# EAGLE board homecontroller_main_new (EAGLE 6.6.0)
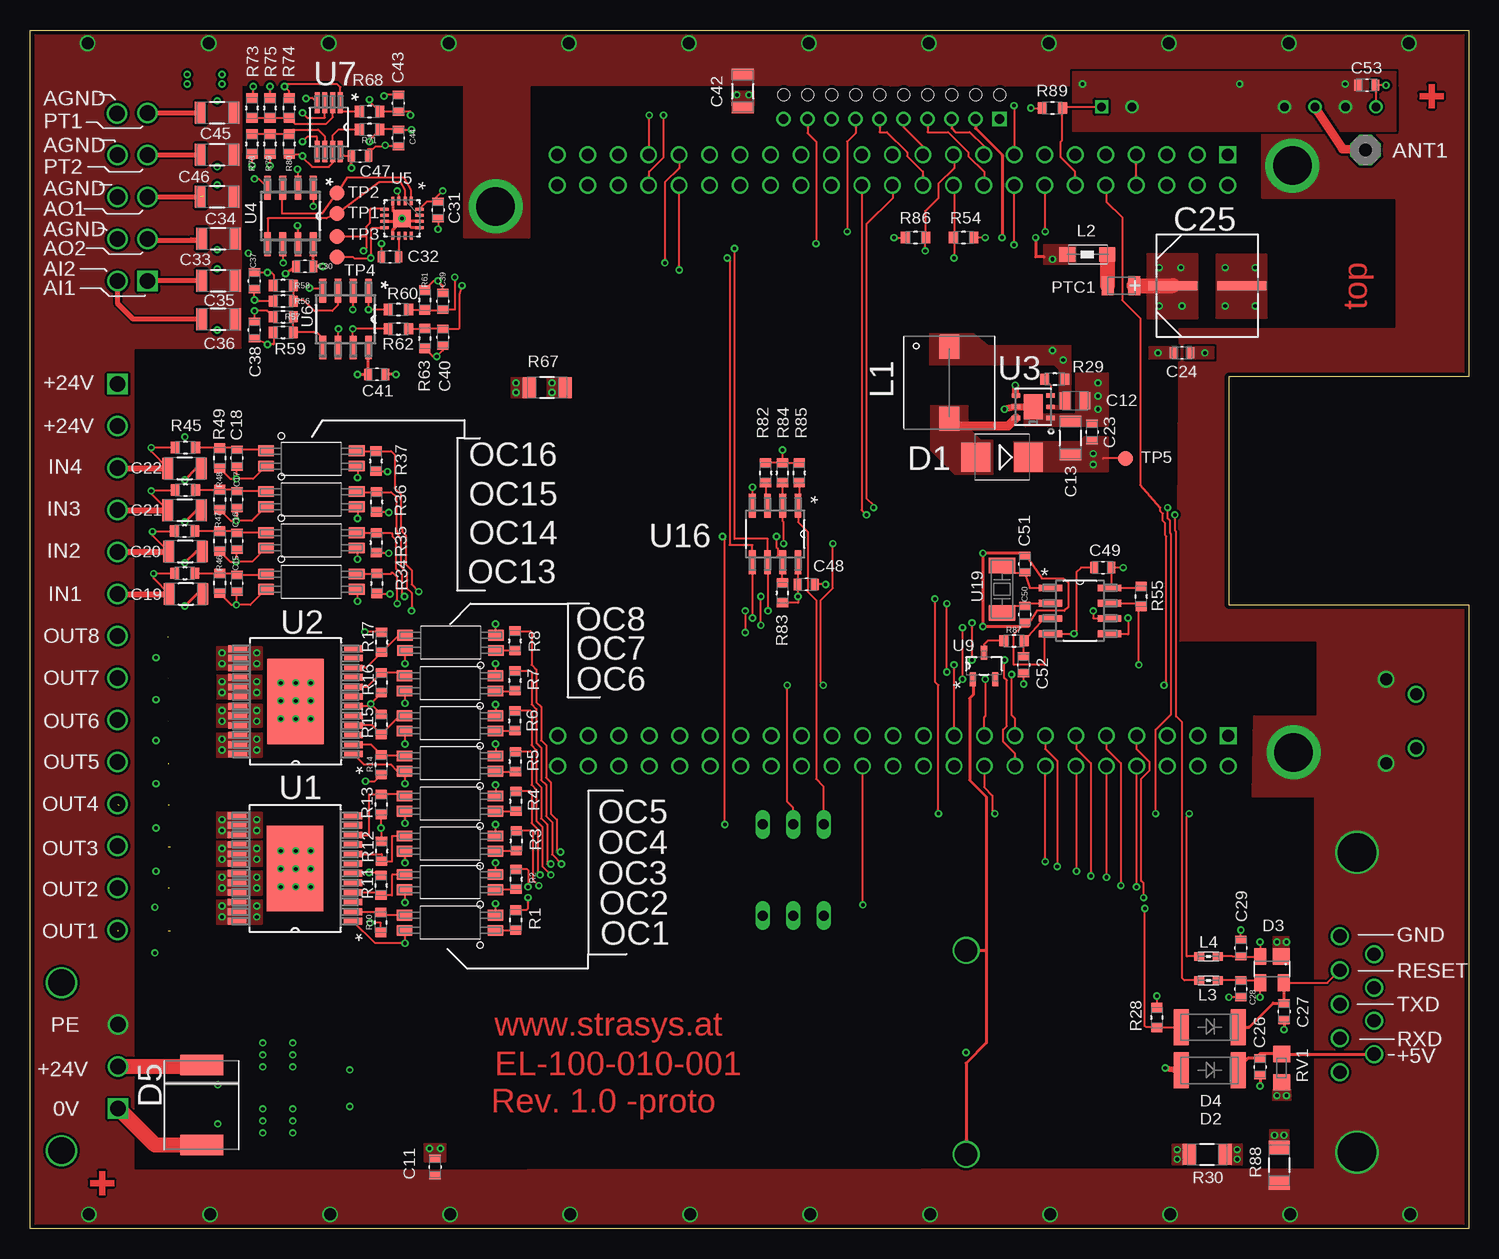
[diagram p7: board, top side]
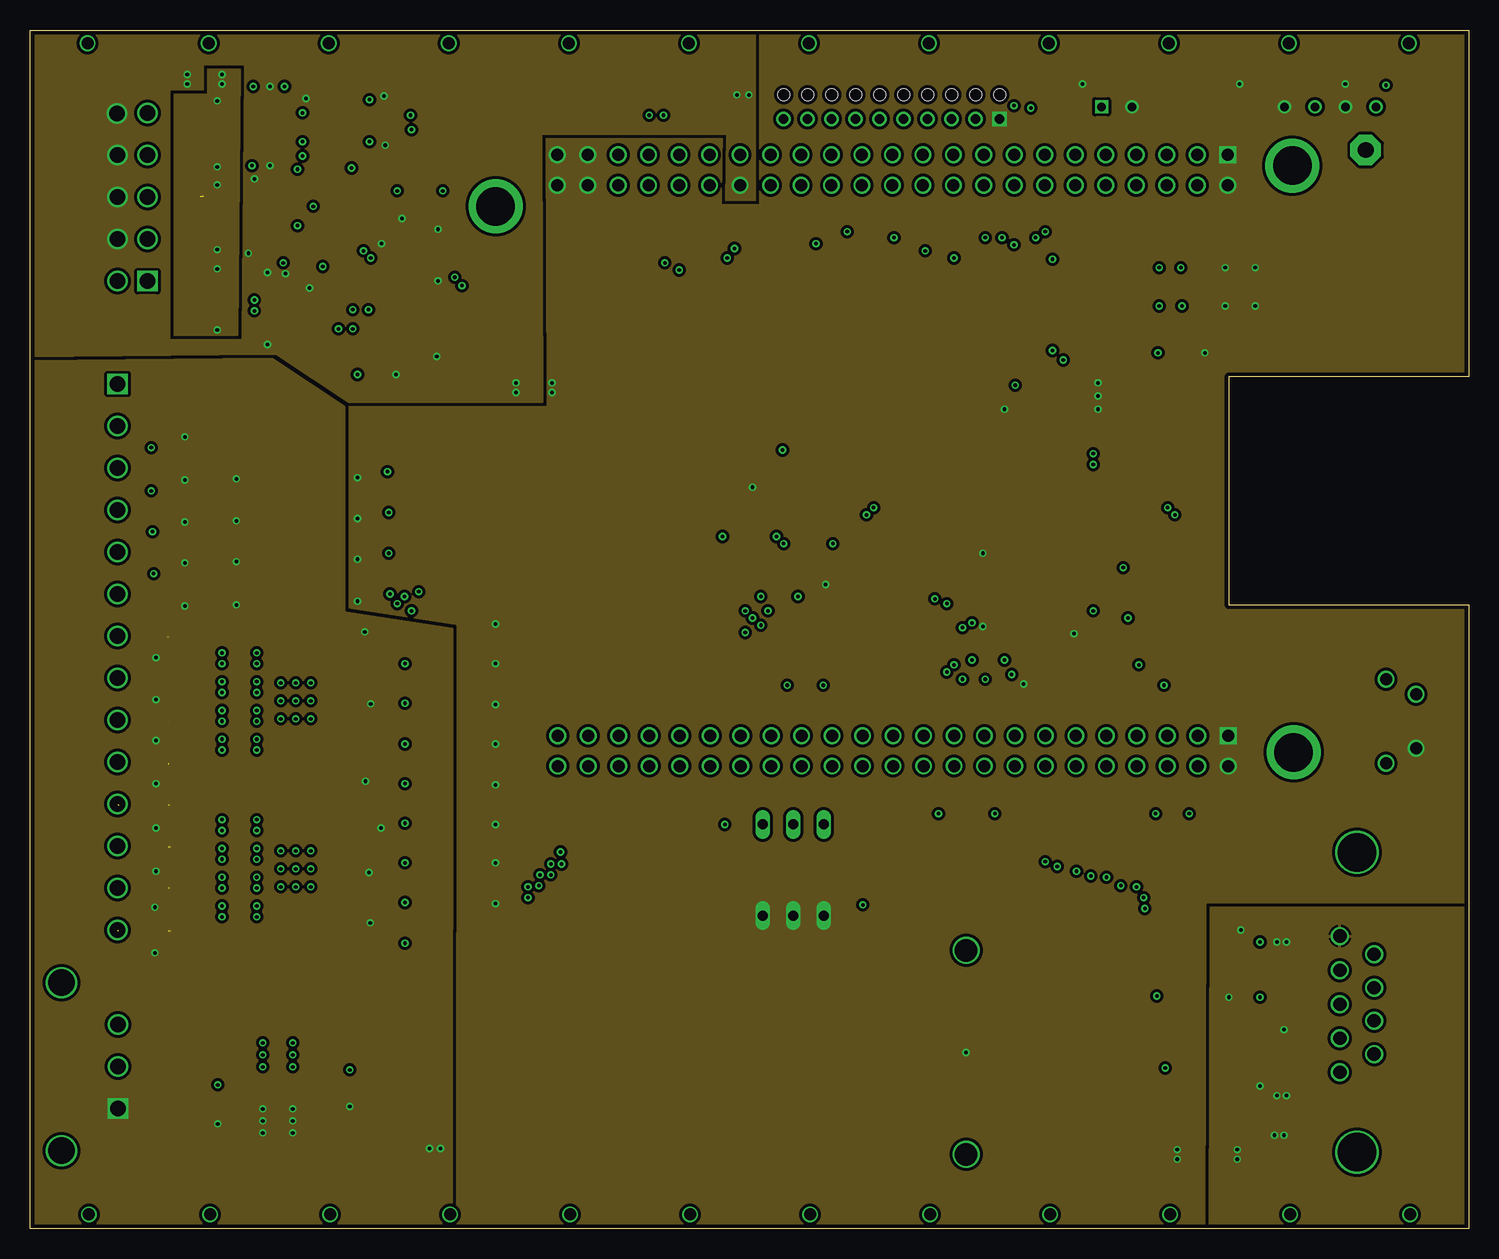
[diagram p8: board, inner layer GND]
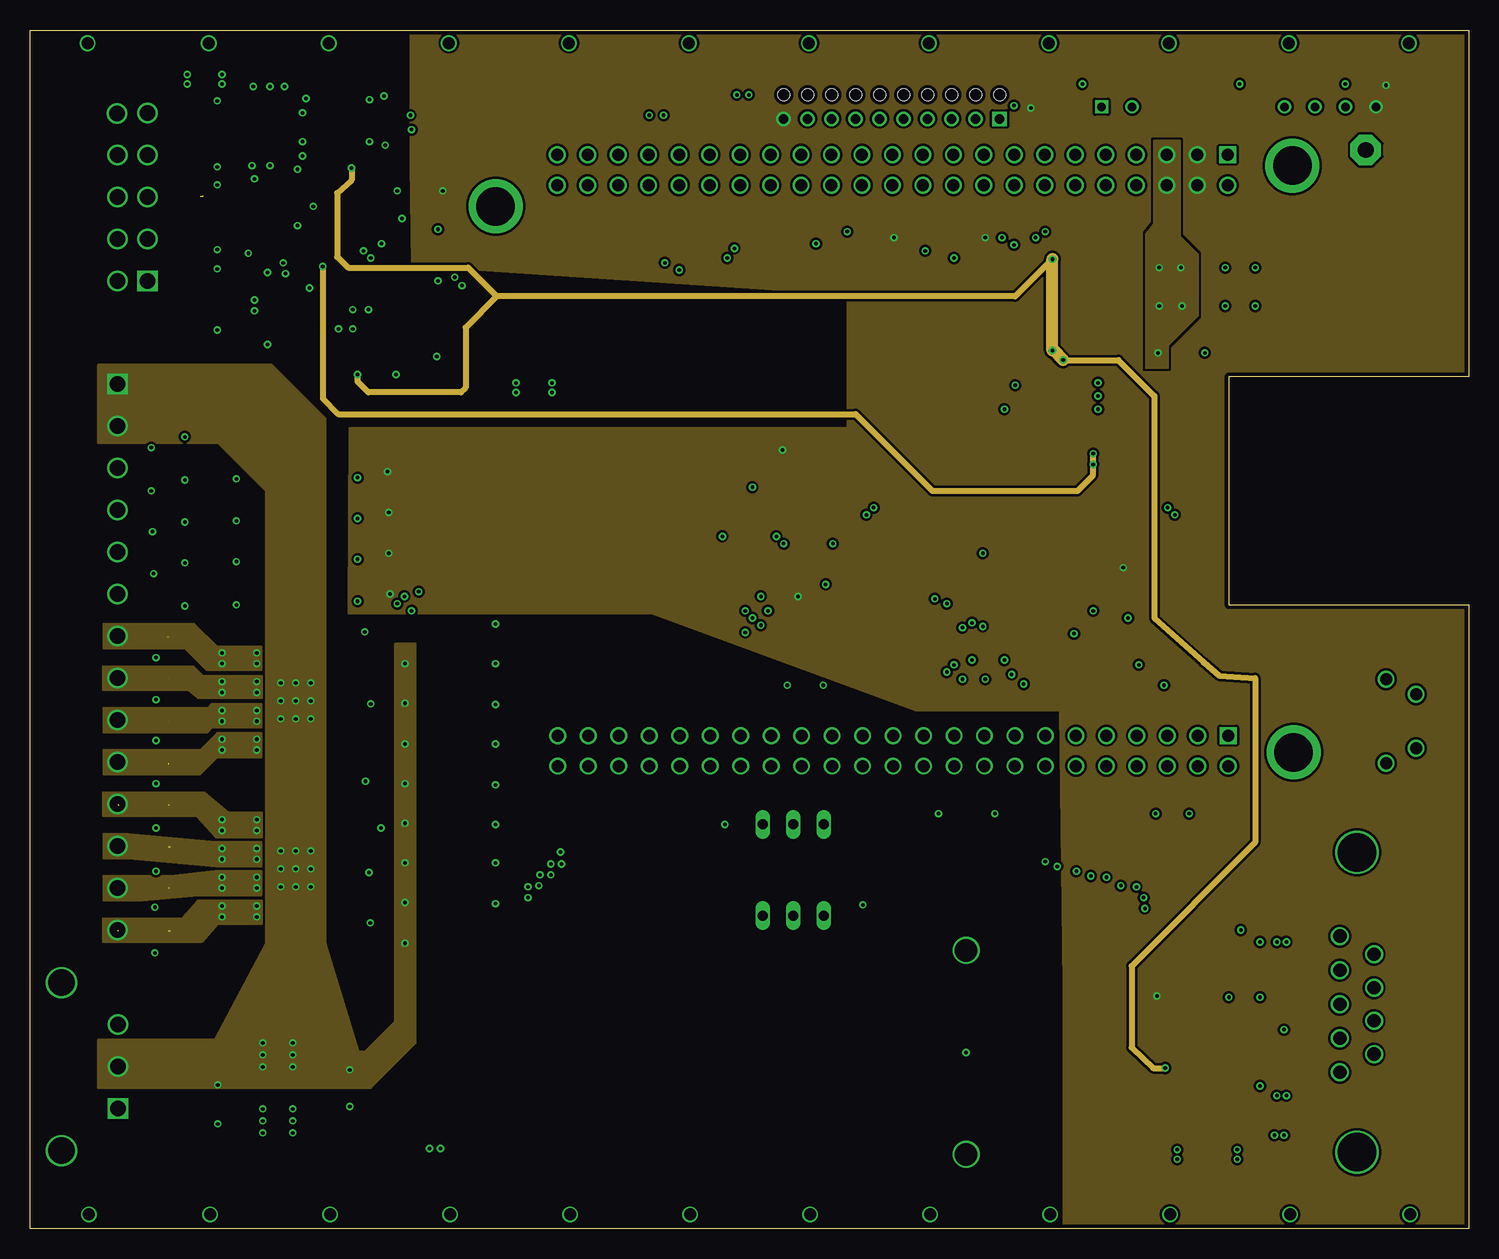
[diagram p9: board, inner layer PWR]
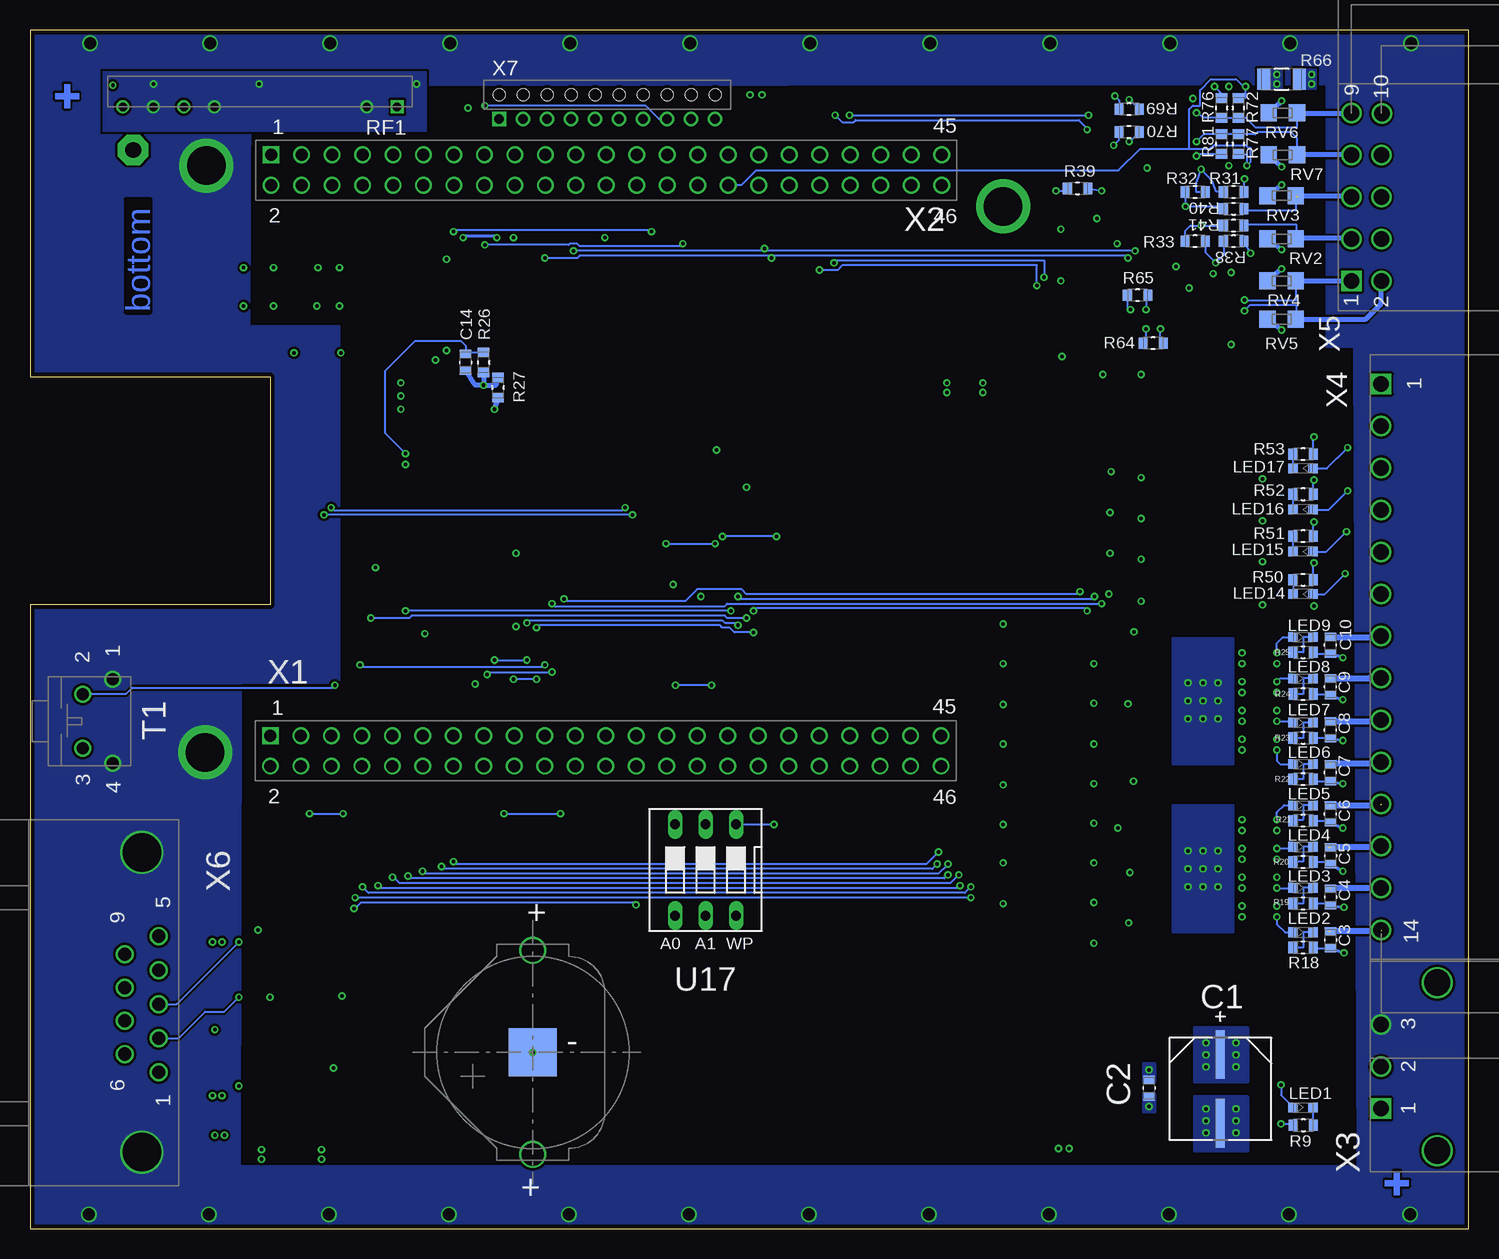
[diagram p10: board, bottom side, seen from below]

Size 119.9 x 99.9 mm. Coordinates in mm from the lower left corner, seen from the top.
Outline: 0,0 0,99.9 119.9,99.9 119.9,71 99.9,71 99.9,52 119.9,52 119.9,0 0,0
Copper layers (1+2*15+16): Top 0.035mm / dielectric 0.38mm / GND 0.035mm / dielectric 0.71mm / PWR 0.035mm / dielectric 0.38mm / Bottom 0.035mm
Design rules "PCB-POOL Standard_ML4": minimum track width 0.15mm, minimum drill 0.3mm, track to track 0.15mm, track to pad 0.15mm, pad to pad 0.15mm, via to via 0.15mm, smd to smd 0.15mm, copper to edge 0.3mm, drill to drill 0.2mm, minimum pad ring 0.2mm, minimum via ring 0.15mm, stop-mask expansion 0.075mm, vias tented up to drill 0mil, thermal gap 0.2mm
Net classes: 0 default: clearance 0.205 mm
vRestrict: area 41.2,83.4 to 102.9,92.5; area 41.3,34.9 to 103,45; area 105.3,2.7 to 119.8,35.9; area 35.1,81.8 to 42.6,88.4; area 101.5,85.1 to 109,91.7; area 101.9,36.3 to 109.4,42.9; area 69,5.7 to 87.6,23.4

## Footprints (pad centres in the part's own frame; a part is rotated, then mirrored left to right if it is on the bottom)
PAD-01 = drill 1.321 pad 2.54 octagon: 1 0,0
BAT_HOLDER_16MM = smd 4 x 4: P1(-) 0,0 | drill 1.85: P2(+) 8.5,0; P3(+) -8.5,0
CAPAE830X650N = smd 4.064 x 0.762: 1 -2.87,0; 2 2.87,0
CAPC1608X85N = smd 0.66 x 0.94: 1 -0.711,0; 2 0.711,0
CAPC2013X140N = smd 0.914 x 1.448: 1 -0.813,0; 2 0.813,0
CAPC3216X180N = smd 0.914 x 1.803: 1 -1.397,0; 2 1.397,0
CAPC3216X88N = smd 0.914 x 1.803: 1 -1.397,0; 2 1.397,0
SMB = smd 2.4 x 2.4: A 2.2,0; C -2.2,0
DO-213AB = smd 1.25 x 3: A 2.375,0; C -2.375,0
WE-TVS_SOT143-4L = smd 1.4 x 1.4: 1 -0.76,-1.1 | smd 1 x 1.4: 2 0.96,-1.1; 3 0.96,1.1; 4 -0.96,1.1
SM15T39A = smd 1.7 x 3.6: A 3.325,0; K -3.325,0
WE-PD_7332/7345_PLASTIC_BASE = smd 1.7 x 2: 1 0,3; 2 0,-3
1206 = smd 1.35 x 1.2: 1 -1.675,0; 2 1.675,0
0603 = smd 0.85 x 0.7: 1 -0.775,0; 2 0.775,0
KP-1608QBCD-D-LED = smd 0.8 x 0.8: 1 -0.825,0; 2 0.825,0
SOP-4 = smd 1.3 x 0.9: 1 -3.701,0.613; 2 -3.701,-0.657; 3 3.869,-0.657; 4 3.869,0.613
MF-PSMF = smd 1 x 1.6: P$1 -1.1,0; P$2 1.1,0
RESC1608X60N = smd 0.762 x 0.94: 1 -0.838,0; 2 0.838,0
RESC3216X71N = smd 1.118 x 1.753: 1 -1.473,0; 2 1.473,0
TX_SAW_MID = drill 0.7 square: 1 0,0 | drill 0.7: 2 2.54,0; 7 15.24,0; 8 17.78,0; 9 20.32,0; 10 22.86,0
WESURGE_0603 = smd 1.35 x 1.4: 1 -1.175,0; 2 1.175,0
WS-TST-90° = drill 1: 1 0,0; 2 1.25,-2.5; 3 5.75,-2.5; 4 7,0
B1,27 = smd 1.27 x 1.27: TP 0,0
SOP80P1030X247-25N = smd 1.549 x 0.559: 1 -4.826,4.394; 2 -4.826,3.607; 3 -4.826,2.794; 4 -4.826,2.007; 5 -4.826,1.194; 6 -4.826,0.406; 7 -4.826,-0.406; 8 -4.826,-1.194; 9 -4.826,-2.007; 10 -4.826,-2.794; 11 -4.826,-3.607; 12 -4.826,-4.394; 13 4.826,-4.394; 14 4.826,-3.607; 15 4.826,-2.794; 16 4.826,-2.007; 17 4.826,-1.194; 18 4.826,-0.406; 19 4.826,0.406; 20 4.826,1.194; 21 4.826,2.007; 22 4.826,2.794; 23 4.826,3.607; 24 4.826,4.394 | smd 4.699 x 7.112: 25 0,0
DFN300X300X80-7N = smd 0.711 x 0.356: 1 -1.448,0.94; 2 -1.448,0; 3 -1.448,-0.94; 4 1.448,-0.94; 5 1.448,0; 6 1.448,0.94 | smd 1.6 x 2.108: 7 0,0
SOIC127P600X175-8N = smd 1.981 x 0.559: 1 -2.362,1.905; 2 -2.362,0.635; 3 -2.362,-0.635; 4 -2.362,-1.905; 5 2.362,-1.905; 6 2.362,-0.635; 7 2.362,0.635; 8 2.362,1.905
QFN50P300X300X80-17N = smd 0.7 x 0.25: 1 -1.448,0.762; 2 -1.448,0.254; 3 -1.448,-0.254; 4 -1.448,-0.762; 9 1.448,-0.762; 10 1.448,-0.254; 11 1.448,0.254; 12 1.448,0.762 | smd 0.25 x 0.7: 5 -0.762,-1.448; 6 -0.254,-1.448; 7 0.254,-1.448; 8 0.762,-1.448; 13 0.762,1.448; 14 0.254,1.448; 15 -0.254,1.448; 16 -0.762,1.448 | smd 1.448 x 1.448: 17 0,0
SOP65P490X110-8N = smd 1.778 x 0.432: 1 -2.032,0.965; 2 -2.032,0.33; 3 -2.032,-0.33; 4 -2.032,-0.965; 5 2.032,-0.965; 6 2.032,-0.33; 7 2.032,0.33; 8 2.032,0.965
SOIC127P600X175-8N' = smd 1.981 x 0.559: 1 -2.464,1.905; 2 -2.464,0.635; 3 -2.464,-0.635; 4 -2.464,-1.905; 5 2.464,-1.905; 6 2.464,-0.635; 7 2.464,0.635; 8 2.464,1.905
SOT95P280X145-5N = smd 1.168 x 0.533: 1 -1.092,0.94; 2 -1.092,-0.94; 3 1.092,0
DS-03 = drill 0.813 long: 1 -2.54,-3.81; 2 0,-3.81; 3 2.54,-3.81; 4 2.54,3.81; 5 0,3.81; 6 -2.54,3.81
ABS-10 = smd 1.3 x 2.2: P$1 -1.975,0; P$2 1.975,0
2,54_STIFTLEIST_2X23 = drill 1 square: P1 0,0 | drill 1: P2 0,-2.54; P3 2.54,0; P4 2.54,-2.54; P5 5.08,0; P6 5.08,-2.54; P7 7.62,0; P8 7.62,-2.54; P9 10.16,0; P10 10.16,-2.54; P11 12.7,0; P12 12.7,-2.54; P13 15.24,0; P14 15.24,-2.54; P15 17.78,0; P16 17.78,-2.54; P17 20.32,0; P18 20.32,-2.54; P19 22.86,0; P20 22.86,-2.54; P21 25.4,0; P22 25.4,-2.54; P23 27.94,0; P24 27.94,-2.54; P25 30.48,0; P26 30.48,-2.54; P27 33.02,0; P28 33.02,-2.54; P29 35.56,0; P30 35.56,-2.54; P31 38.1,0; P32 38.1,-2.54; P33 40.64,0; P34 40.64,-2.54; P35 43.18,0; P36 43.18,-2.54; P37 45.72,0; P38 45.72,-2.54; P39 48.26,0; P40 48.26,-2.54; P41 50.8,0; P42 50.8,-2.54; P43 53.34,0; P44 53.34,-2.54; P45 55.88,0; P46 55.88,-2.54
90F-3 = drill 1.3 square: 1 0,0 | drill 1.3: 2 3.5,0; 3 7,0 | drill 2.2: 4 -3.5,-4.7; 5 10.5,-4.7
90G-14 = drill 1.3 square: 1 0,0 | drill 1.3: 2 -3.5,0; 3 -7,0; 4 -10.5,0; 5 -14,0; 6 -17.5,0; 7 -21,0; 8 -24.5,0; 9 -28,0; 10 -31.5,0; 11 -35,0; 12 -38.5,0; 13 -42,0; 14 -45.5,0
S2L-90G-10 = drill 1.3 square: 1 0,0 | drill 1.3: 2 0,-2.5; 3 3.5,0; 4 3.5,-2.5; 5 7,0; 6 7,-2.5; 7 10.5,0; 8 10.5,-2.5; 9 14,0; 10 13.97,-2.54
SUB-D_HD-20 = drill 1.1: 1 7.065,2.84; 2 4.225,2.84; 3 1.385,2.84; 4 -1.455,2.84; 5 -4.295,2.84; 6 5.54,0; 7 2.77,0; 8 0,0; 9 -2.77,0 | drill 3.2: G1 -11.275,1.42; G2 13.715,1.42
2MM-1-REIH-10 = drill 0.8 square: 1 0,-2 | drill 0.8: 2 2,-2; 3 4,-2; 4 6,-2; 5 8,-2; 6 10,-2; 7 12,-2; 8 14,-2; 9 16,-2; 10 18,-2 | hole 1: 2,0; 4,0; 6,0; 8,0; 10,0; 12,0; 14,0; 16,0; 18,0; 0,0

## Placement (x,y rotation side)
ANT1  [PAD-01]  111.3,89.9 0 top
BAT1  BATTERY_COIN_CLIP  [BAT_HOLDER_16MM]  78,14.7 270 bottom
C1  47µF  [CAPAE830X650N]  20.7,11.66 270 bottom
C2  0.1uF  [CAPC1608X85N]  26.65,11.72 90 bottom
C3  10nF 50V  [CAPC1608X85N]  11.52,24.07 90 bottom
C4  10nF 50V  [CAPC1608X85N]  11.52,27.65 90 bottom
C5  10nF 50V  [CAPC1608X85N]  11.52,31.09 90 bottom
C6  10nF 50V  [CAPC1608X85N]  11.53,34.57 90 bottom
C7  10nF 50V  [CAPC1608X85N]  11.53,38.01 90 bottom
C8  10nF 50V  [CAPC1608X85N]  11.53,41.57 90 bottom
C9  10nF 50V  [CAPC1608X85N]  11.53,45.17 90 bottom
C10  10nF 50V  [CAPC1608X85N]  11.53,48.64 90 bottom
C11  4.7nF 50V  [CAPC1608X85N]  33.75,5.15 90 top
C12  10uF 10V  [CAPC2013X140N]  87.1,69 180 top
C13  10uF 25V  [CAPC3216X180N]  86.7,65.9 270 top
C14  220pF 50V  [CAPC1608X85N]  83.6,72.2 90 bottom
C15  10nF 50V  [CAPC1608X85N]  17.24,53.8 90 top
C16  10nF 50V  [CAPC1608X85N]  17.24,57.31 90 top
C17  10nF 50V  [CAPC1608X85N]  17.24,60.77 90 top
C18  10nF 50V  [CAPC1608X85N]  17.24,64.23 90 top
C19  1000pF 1kV  [CAPC3216X88N]  12.99,52.9 180 top
C20  1000pF 1kV  [CAPC3216X88N]  12.94,56.44 180 top
C21  1000pF 1kV  [CAPC3216X88N]  12.89,59.88 180 top
C22  1000pF 1kV  [CAPC3216X88N]  12.89,63.37 180 top
C23  22nF 50V  [CAPC1608X85N]  88.5,66.4 270 top
C24  0.1uF  [CAPC1608X85N]  96,73 180 top
C25  47µF  [CAPAE830X650N]  98.1,78.6 0 top
C26  0.1uF  [CAPC1608X85N]  102.5,13.5 90 top
C27  0.1uF  [CAPC1608X85N]  104.5,18.1 90 top
C28  100pF  [CAPC1608X85N]  100.9,20 90 top
C29  100pF  [CAPC1608X85N]  100.9,23.4 270 top
C30  0.1uF  [CAPC1608X85N]  22.9,80.2 0 top
C31  0.1uF  [CAPC1608X85N]  34,84.9 90 top
C32  0.1uF  [CAPC1608X85N]  30,81 0 top
C33  1000pF 1kV  [CAPC3216X88N]  15.7,82.5 180 top
C34  1000pF 1kV  [CAPC3216X88N]  15.6,86 180 top
C35  1000pF  [CAPC3216X88N]  15.7,79 180 top
C36  1000pF  [CAPC3216X88N]  15.7,75.8 180 top
C37  82000pF  [CAPC1608X85N]  18.7,79 270 top
C38  82000pF  [CAPC1608X85N]  18.7,74.9 90 top
C39  180pF  [CAPC1608X85N]  34.4,77.3 270 top
C40  180pF  [CAPC1608X85N]  34.4,74.3 90 top
C41  0.1uF  [CAPC1608X85N]  28.9,71.2 180 top
C42  1000pF 1kV  [CAPC3216X88N]  59.4,94.8 270 top
C43  180pF  [CAPC1608X85N]  30.7,93.8 270 top
C44  180pF  [CAPC1608X85N]  30.7,90.9 90 top
C45  1000pF 1kV  [CAPC3216X88N]  15.6,93 180 top
C46  1000pF  [CAPC3216X88N]  15.6,89.5 180 top
C47  0.1uF  [CAPC1608X85N]  27.5,89.4 180 top
C48  0.1uF  [CAPC1608X85N]  64.7,53.7 180 top
C49  0.1uF  [CAPC1608X85N]  89.4,55.1 0 top
C50  12pF  [CAPC1608X85N]  82.9,51.2 90 top
C51  10pF  [CAPC1608X85N]  82.9,55.4 270 top
C52  100pF  [CAPC1608X85N]  82.8,47 90 top
C53  0.1uF  [CAPC1608X85N]  111.4,95.3 0 top
D1  20V 2A  [SMB]  81,64.3 180 top
D2  BYM11-1000  [DO-213AB]  98.3,13.2 180 top
D3  [WE-TVS_SOT143-4L]  103.5,21.6 180 top
D4  BYM11-1000  [DO-213AB]  98.3,16.8 180 top
D5  SM15T39A  [SM15T39A]  14.31,10.31 270 top
DRILEGEND  [DRILEGEND]  -11.18,-7.26 0 top  (outside the outline)
L1  6.8µH 2.91A  [WE-PD_7332/7345_PLASTIC_BASE]  76.6,70.5 0 top
L2  [1206]  88.1,81.2 0 top
L3  [0603]  98.2,20.7 0 top
L4  [0603]  98.2,22.7 0 top
LED1  KP-1608QBC-D-LED  [KP-1608QBCD-D-LED]  13.81,10.12 0 bottom
LED2  KP-1608QBC-D-LED  [KP-1608QBCD-D-LED]  13.81,24.71 0 bottom
LED3  KP-1608QBC-D-LED  [KP-1608QBCD-D-LED]  13.81,28.42 0 bottom
LED4  KP-1608QBC-D-LED  [KP-1608QBCD-D-LED]  13.81,31.84 0 bottom
LED5  KP-1608QBC-D-LED  [KP-1608QBCD-D-LED]  13.81,35.28 0 bottom
LED6  KP-1608QBC-D-LED  [KP-1608QBCD-D-LED]  13.81,38.74 0 bottom
LED7  KP-1608QBC-D-LED  [KP-1608QBCD-D-LED]  13.81,42.18 0 bottom
LED8  KP-1608QBC-D-LED  [KP-1608QBCD-D-LED]  13.81,45.87 0 bottom
LED9  KP-1608QBC-D-LED  [KP-1608QBCD-D-LED]  13.81,49.31 0 bottom
LED14  KP-1608QBC-D-LED  [KP-1608QBCD-D-LED]  13.81,52.9 180 bottom
LED15  KP-1608QBC-D-LED  [KP-1608QBCD-D-LED]  13.81,56.44 180 bottom
LED16  KP-1608QBC-D-LED  [KP-1608QBCD-D-LED]  13.81,59.93 180 bottom
LED17  KP-1608QBC-D-LED  [KP-1608QBCD-D-LED]  13.81,63.37 180 bottom
OC1  TCMT1106  [SOP-4]  35.08,25.48 180 top
OC2  TCMT1106  [SOP-4]  35.08,28.86 180 top
OC3  TCMT1106  [SOP-4]  35.08,32.07 180 top
OC4  TCMT1106  [SOP-4]  35.08,35.41 180 top
OC5  TCMT1106  [SOP-4]  35.08,38.75 180 top
OC6  TCMT1106  [SOP-4]  35.08,42.09 180 top
OC7  TCMT1106  [SOP-4]  35.08,45.43 180 top
OC8  TCMT1106  [SOP-4]  35.13,48.8 180 top
OC13  TCMT1106  [SOP-4]  23.36,53.95 0 top
OC14  TCMT1106  [SOP-4]  23.36,57.39 0 top
OC15  TCMT1106  [SOP-4]  23.36,60.83 0 top
OC16  TCMT1106  [SOP-4]  23.36,64.22 0 top
PTC1  MF-PSMF075X  [MF-PSMF]  90.9,78.6 0 top
R1  1K Ohms  [RESC1608X60N]  40.48,25.73 270 top
R2  1K Ohms  [RESC1608X60N]  40.5,29.13 270 top
R3  1K Ohms  [RESC1608X60N]  40.53,32.33 270 top
R4  1K Ohms  [RESC1608X60N]  40.49,35.63 270 top
R5  1K Ohms  [RESC1608X60N]  40.45,38.93 270 top
R6  1K Ohms  [RESC1608X60N]  40.41,42.33 270 top
R7  1K Ohms  [RESC1608X60N]  40.42,45.68 270 top
R8  1K Ohms  [RESC1608X60N]  40.42,49 270 top
R9  10K Ohms  [RESC1608X60N]  13.79,8.63 180 bottom
R10  47K Ohms  [RESC1608X60N]  29.23,25.53 270 top
R11  47K Ohms  [RESC1608X60N]  29.26,28.62 90 top
R12  47K Ohms  [RESC1608X60N]  29.3,31.47 90 top
R13  47K Ohms  [RESC1608X60N]  29.27,35.36 270 top
R14  47K Ohms  [RESC1608X60N]  29.27,38.67 270 top
R15  47K Ohms  [RESC1608X60N]  29.27,42.03 90 top
R16  47K Ohms  [RESC1608X60N]  29.28,45.51 270 top
R17  47K Ohms  [RESC1608X60N]  29.3,48.88 90 top
R18  10K Ohms  [RESC1608X60N]  13.81,23.44 0 bottom
R19  10K Ohms  [RESC1608X60N]  13.81,27.11 0 bottom
R20  10K Ohms  [RESC1608X60N]  13.81,30.57 0 bottom
R21  10K Ohms  [RESC1608X60N]  13.81,34.01 0 bottom
R22  10K Ohms  [RESC1608X60N]  13.81,37.47 0 bottom
R23  10K Ohms  [RESC1608X60N]  13.81,40.91 0 bottom
R24  10K Ohms  [RESC1608X60N]  13.8,44.56 0 bottom
R25  10K Ohms  [RESC1608X60N]  13.81,48.04 0 bottom
R26  86.6K Ohms  [RESC1608X60N]  82.1,72.2 270 bottom
R27  10.2K Ohms  [RESC1608X60N]  80.9,70.1 270 bottom
R28  4.7K Ohms  [RESC1608X60N]  93.9,17.6 90 top
R29  1 MOhms  [RESC1608X60N]  85.4,70.8 0 top
R30  0 Ohms  [RESC3216X71N]  98.1,6.2 0 top
R31  5.1K Ohms  [RESC1608X60N]  19.6,86.4 180 bottom
R32  15K Ohms  [RESC1608X60N]  22.8,86.4 0 bottom
R33  15K Ohms  [RESC1608X60N]  22.8,82.3 0 bottom
R34  4.7K Ohms  [RESC1608X60N]  28.9,53.78 270 top
R35  4.7K Ohms  [RESC1608X60N]  28.86,57.18 270 top
R36  4.7K Ohms  [RESC1608X60N]  28.88,60.57 270 top
R37  4.7K Ohms  [RESC1608X60N]  28.83,63.98 270 top
R38  5.1K Ohms  [RESC1608X60N]  19.6,82.3 180 bottom
R39  4.7K Ohms  [RESC1608X60N]  32.6,86.7 180 bottom
R40  1K Ohms  [RESC1608X60N]  19.6,85 180 bottom
R41  1K Ohms  [RESC1608X60N]  19.6,83.6 180 bottom
R42  4.7K Ohms  [RESC1608X60N]  12.9,54.63 0 top
R43  4.7K Ohms  [RESC1608X60N]  12.89,58.15 0 top
R44  4.7K Ohms  [RESC1608X60N]  12.95,61.56 0 top
R45  4.7K Ohms  [RESC1608X60N]  12.95,65.1 0 top
R46  1K Ohms  [RESC1608X60N]  15.81,53.8 270 top
R47  1K Ohms  [RESC1608X60N]  15.81,57.31 270 top
R48  1K Ohms  [RESC1608X60N]  15.81,60.77 270 top
R49  1K Ohms  [RESC1608X60N]  15.81,64.23 270 top
R50  10K Ohms  [RESC1608X60N]  13.81,54.08 0 bottom
R51  10K Ohms  [RESC1608X60N]  13.81,57.72 0 bottom
R52  10K Ohms  [RESC1608X60N]  13.81,61.21 0 bottom
R53  10K Ohms  [RESC1608X60N]  13.81,64.55 0 bottom
R54  1.4K Ohms  [RESC1608X60N]  77.8,82.6 180 top
R55  10K Ohms  [RESC1608X60N]  92.6,52.7 90 top
R56  4.7K Ohms  [RESC1608X60N]  21.1,77.3 180 top
R57  4.7K Ohms  [RESC1608X60N]  21.1,76 180 top
R58  4.7K Ohms  [RESC1608X60N]  21.1,78.6 0 top
R59  4.7K Ohms  [RESC1608X60N]  21.1,74.7 0 top
R60  590 Ohms  [RESC1608X60N]  30.7,76.6 0 top
R61  536 Ohms  [RESC1608X60N]  32.9,77.4 90 top
R62  590 Ohms  [RESC1608X60N]  30.7,75 0 top
R63  536 Ohms  [RESC1608X60N]  32.9,74.2 270 top
R64  49.9 Ohms  [RESC1608X60N]  26.3,73.8 180 bottom
R65  49.9 Ohms  [RESC1608X60N]  27.6,77.8 180 bottom
R66  0 Ohms  [RESC3216X71N]  15.6,95.8 180 bottom
R67  0 Ohms  [RESC3216X71N]  43.1,70.1 180 top
R68  604 Ohms  [RESC1608X60N]  28.3,93.1 0 top
R69  392 Ohms  [RESC1608X60N]  28.3,93.3 180 bottom
R70  392 Ohms  [RESC1608X60N]  28.3,91.4 180 bottom
R71  604 Ohms  [RESC1608X60N]  28.3,91.6 0 top
R72  1.78K Ohms  [RESC1608X60N]  19.2,93.4 270 bottom
R73  8.66K Ohms  [RESC1608X60N]  18.5,93.4 270 top
R74  82.5K Ohms  [RESC1608X60N]  21.6,93.4 90 top
R75  453 Ohms  [RESC1608X60N]  20,93.4 90 top
R76  210K Ohms  [RESC1608X60N]  20.6,93.4 90 bottom
R77  1.78K Ohms  [RESC1608X60N]  19.2,90.4 90 bottom
R78  8.66K Ohms  [RESC1608X60N]  18.5,90.4 90 top
R79  453 Ohms  [RESC1608X60N]  20,90.4 270 top
R80  82.5K Ohms  [RESC1608X60N]  21.6,90.4 270 top
R81  210K Ohms  [RESC1608X60N]  20.6,90.4 270 bottom
R82  4.7K Ohms  [RESC1608X60N]  61.3,63 270 top
R83  10K Ohms  [RESC1608X60N]  62.7,53 90 top
R84  4.7K Ohms  [RESC1608X60N]  62.7,63 270 top
R85  4.7K Ohms  [RESC1608X60N]  64.1,63 270 top
R86  1.4K Ohms  [RESC1608X60N]  73.8,82.6 0 top
R87  1K Ohms  [RESC1608X60N]  82,49 180 top
R88  0 Ohms  [RESC3216X71N]  104.1,5.3 270 top
R89  51K Ohms  [RESC1608X60N]  85.2,93.4 180 top
RF1  TX-FM-MID-3V  [TX_SAW_MID]  89.3,93.5 180 bottom
RV1  [WESURGE_0603]  104.3,13.4 90 top
RV2  [WESURGE_0603]  15.6,82.5 0 bottom
RV3  [WESURGE_0603]  15.6,86.1 0 bottom
RV4  [WESURGE_0603]  15.6,79 0 bottom
RV5  [WESURGE_0603]  15.6,75.8 0 bottom
RV6  [WESURGE_0603]  15.5,93 0 bottom
RV7  [WESURGE_0603]  15.5,89.5 0 bottom
T1  WS-TST-90°  [WS-TST-90°]  113,45.8 270 bottom
TP1  TPB1,27  [B1,27]  25.6,84.6 0 top
TP2  TPB1,27  [B1,27]  25.6,86.3 0 top
TP3  TPB1,27  [B1,27]  25.6,82.7 0 top
TP4  TPB1,27  [B1,27]  25.6,81 0 top
TP5  TPB1,27  [B1,27]  91.3,64.2 0 top
U1  VNI4140K-32  [SOP80P1030X247-25N]  22.09,30.03 180 top
U2  VNI4140K-32  [SOP80P1030X247-25N]  22.14,43.95 180 top
U3  LMR62421XSD  [DFN300X300X80-7N]  83.6,68.5 180 top
U4  OPA2170AID  [SOIC127P600X175-8N]  21.7,84.4 270 top
U5  LTC2635HUD-LMI10PBF  [QFN50P300X300X80-17N]  31,84.2 270 top
U6  OPA2170AID  [SOIC127P600X175-8N]  26.3,75.8 270 top
U7  OPA2188AIDGKR  [SOP65P490X110-8N]  24.9,91.8 270 top
U8  MCP7940N-I/SN  [SOIC127P600X175-8N']  87.5,51.5 0 top
U9  PMEG2005ET  [SOT95P280X145-5N]  79.5,46.9 90 top
U16  24AA256-I/SN  [SOIC127P600X175-8N]  62.1,57.9 270 top
U17  SW-DIL-3  [DS-03]  63.6,29.9 180 bottom
U19  ABS10-32.768KHZ-7-T  [ABS-10]  81,53.3 270 top
U$1  [PASSER_SMD4]  6,3.8 0 top
U$3  [PASSER_SMD4]  116.8,94.4 0 top
U$16  [PASSER_SMD4]  116.8,94.4 0 bottom
U$17  [PASSER_SMD4]  6,3.8 0 bottom
X1  944-12-46-00  [2,54_STIFTLEIST_2X23]  99.86,41.1 0 bottom
X2  944-12-46-00  [2,54_STIFTLEIST_2X23]  99.81,89.5 0 bottom
X3  SL3.50/2/90F Weidmüller  [90F-3]  7.33,10.01 90 bottom
X4  90G-14  [90G-14]  7.3,70.4 90 bottom
X5  S2L3.50/10/90G Weidmüller  [S2L-90G-10]  9.79,78.97 90 bottom
X6  HD-20  [SUB-D_HD-20]  112,20.1 270 bottom
X7  745-010-1-60  [2MM-1-REIH-10]  80.8,94.5 0 bottom

## Tracks (layer width: path | path; a pad name or v marks a point on that pad's centre or on a via)
0V  (via drill 0.3)
  Top 0.15: U1.6 26.92,29.7 v28.25,29.7 29.26,29.7 R11.2 | R10.2 29.23,25.5 v28.35,25.5 | R12.2 29.25,32.31 v29.25,33.4 29.25,34.52 R13.2 | v27.95,37.3 28.74,37.3 R14.2 | v28.4,43.75 R15.2 | v28.4,43.75 29.28,44.63 R16.2 | v28.4,43.75 28.19,43.54 U2.6 | R17.2 29.3,49.75 v27.9,49.75 | C17.1 17.24,59.04 v17.2,59 | R48.2 16.74,59 v17.2,59 | R49.2 16.7,62.5 v17.2,62.5 | C18.1 17.2,63.48 v17.2,62.5 | C15.1 17.2,53.05 v17.2,52 | C16.1 17.2,56.56 v17.2,55.6 | R47.2 16.68,55.6 v17.2,55.6 | R46.2 16.77,52 v17.2,52 | OC15.2 18.49,59 v17.2,59 | OC13.2 18.37,52 v17.2,52 | OC14.2 18.53,55.6 v17.2,55.6 | OC16.2 18.6,62.5 v17.2,62.5 | D5.A 13.41,7.62 13.41,7 | 7.4,10 7.06,10.16 X3.1
  Top 0.25: C22.1 13.87,63.37 v12.9,62.4 | C21.1 13.88,59.88 v12.9,58.9 | C20.1 13.84,56.44 v12.9,55.5 | C19.1 13.9,52.9 v12.9,51.9
  Top 1.25: 7.4,10 10.4,7 13.41,7 13.9,7
  Bottom 0.15: v15.65,8.75 14.75,8.75 R9.2 | R21.2 11.68,34.01 C6.1 | R20.2 11.52,30.57 C5.1 | R19.2 11.52,27.11 C4.1 | R18.2 12.97,23.36 C3.1 | R25.2 12.97,47.93 C10.1 | R24.2 11.53,44.56 C9.1 | R23.2 11.53,40.91 C8.1 | R22.2 12.97,37.3 C7.1 | R50.2 12.97,55.43 v12.9,55.5 | R51.2 12.97,58.83 v12.9,58.9 | R52.2 12.97,62.33 v12.9,62.4 | R53.2 12.97,65.93 v12.9,66
  Bottom 0.25: C6.1 v10.5,33.4 | C5.1 v10.5,29.8 | C4.1 v10.4,26.8 | C3.1 v10.4,23 | C7.1 v10.5,37.1 | C8.1 v10.5,40.7 | C9.1 v10.5,44.1 | v10.5,47.6 C10.1
  other vias: 19.4,10 19.4,9 19.4,8 21.9,10 21.9,9 21.9,8 26.65,10.2 33.3,6.7 34.2,6.7
  pour GND (isolate 0.25, no thermals): -0.1,72.3 20.1,72.5 26.15,68.5 26.15,51.4 35.15,50 35.1,-0.1 0,0
  pour Bottom (no thermals): 18.4,11 22.9,11 22.9,6.5 18.4,6.5
  pour Bottom (no thermals): 26.15,11.25 27.15,11.25 27.15,9.75 26.15,9.75
  pour Top (no thermals): 32.9,7.1 34.6,7.1 34.6,5.6 32.9,5.6
24AA_A0
  Top 0.15: R85.2 64.1,60.26 U16.1 64,60.2 64,58.9 64.8,58.1 64.8,53.1 65.5,52.4 65.5,37.5 66.1,36.9 66.1,33.8 U17.3
24AA_A1  (via drill 0.3)
  Top 0.15: R84.2 62.7,60.46 U16.2 62.7,60.2 62.7,59 62.8,58.9 v62.8,57.1 | v66.9,57.1 66.9,53.4 65.9,52.4 65.9,45.5 v66.1,45.3 | v63.1,45.3 63.1,35.6 63.6,35.1 U17.2
  Bottom 0.15: v66.9,57.1 v62.8,57.1 | v63.1,45.3 v66.1,45.3
24AA_WP  (via drill 0.3)
  Top 0.15: R83.2 62.7,55.54 U16.7 62.7,55.6 62.7,56 62.3,56 | 62.3,56 62.2,56 | 62.3,56 62.3,56.7 62.2,56.8 v62.2,57.7 | v57.7,57.7 57.9,57.5 v57.9,33.7
  Bottom 0.15: v57.7,57.7 v62.2,57.7 | v57.9,33.7 61,33.7 U17.1
+3.3V  (via drill 0.3)
  Top 0.15: C31.2 33.51,85.61 | U5.16 33.1,85.61 33.51,85.61 | R55.2 92.47,53.41 U8.8 90.11,53.55 C49.2 v91.1,55.1 | v93.9,19.4 R28.2 | v62.7,64.9 R84.1 | R84.1 R85.1 | R84.1 R82.1 | C48.2 v64,52.7 64,52.16 R83.1 | C48.2 | C48.2 U16.8 | 33.51,85.61 v34.4,86.5 | v72,82.6 R86.1 | v79.6,82.6 R54.1 | v29.8,63.1 28.9,63.1 R37.2 | v29.9,59.7 28.9,59.7 R36.2 | v29.9,56.3 28.9,56.3 R35.2 | v30,52.9 28.9,52.9 R34.2 | v113,95.3 112.2,95.3 | 112.2,95.3 C53.2 | 112.2,93.5 112.2,95.3 | v83.4,93.4 R89.2
  Bottom 0.15: v34.4,86.5 33.4,86.5 33.4,86.7 R39.2
  pour PWR (isolate 0.15, rank 5, no thermals): 31.8,80.3 68.1,77.9 68.1,66.7 26.6,66.7 26.5,51.3 51.8,51.3 73.8,43.2 85.8,43.2 86.1,20.3 86.1,0 119.6,-0.1 119.9,12.7 119.6,52.1 100,52.1 100,71.1 120,71.1 120,100 31.7,100 31.7,88.7
+5V
  Top 0.15: 104.32,14.56 RV1.2 104.9,14.57 104.9,14.5 | X6.6 112,14.5
  Top 0.25: RV1.2 102.46,14.57 C26.2 101.49,14.21 D2.C | 112,14.5 104.9,14.5
+12V  (via drill 0.3)
  Top 0.15: TP5.TP 89.4,64.2 | C30.2
  Top 0.25: v24.4,80.2 C30.2 | C30.2 U4.8
  PWR 0.5: v24.4,80.2 24.4,69.2 25.7,67.9 68.8,67.9 75.2,61.5 87.3,61.5 88.6,62.8 v88.6,63.7 v88.6,64.6
  Bottom 0.15: v88.6,64.6 90.3,66.3 90.3,71.5 87.8,74 84,74 83.6,73.6 C14.2 83.47,73.04 R26.1
  pour Top (no thermals): 82,65.6 87.5,65.6 87.9,66 89.8,66 89.8,63.1 82,63.1
+24V  (via drill 0.3)
  Top 0.15: U1.1 28.75,23.8 v31.25,23.8 31.25,24.83 OC1.4 | v31.25,27.2 31.25,28.21 OC2.4 | v31.25,30.5 31.25,31.42 OC3.4 | v31.25,33.8 31.25,34.8 OC4.4 | v31.25,37.1 31.25,38.14 OC5.4 30.61,38.14 30.05,38.7 27.82,38.7 U2.1 | v31.25,40.4 31.25,41.48 OC6.4 | v31.25,43.8 31.25,44.82 OC7.4 | v31.25,47.1 OC8.4 | 13.41,13.5 13.41,13.97 D5.K | 7.4,13.5 7.06,13.97 X3.2 | v20.9,45.5 21.03,45.72 21.03,44.45 U2.25 | U1.25 22.3,30.48 22.3,31.75 v22.15,31.5
  Top 1.25: 13.9,13.5 13.41,13.5 7.4,13.5
  Bottom 0.15: v15.65,12 15.65,11.13 LED1.1
  other vias: 20.9,30 22.15,30 23.4,30 23.4,31.5 20.9,31.5 20.9,28.5 22.15,28.5 23.4,28.5 21.9,15.5 21.9,14.5 21.9,13.5 19.4,15.5 19.4,14.5 19.4,13.5 26.65,13.25 22.15,45.5 23.4,45.5 20.9,44 23.4,44 22.15,44 20.9,42.5 22.15,42.5 23.4,42.5
  pour Bottom (no thermals): 18.4,16.75 22.9,16.75 22.9,12.25 18.4,12.25
  pour Bottom (no thermals): 26.15,12.25 26.15,13.75 27.15,13.75 27.15,12.25
  pour PWR (isolate 0.15, no thermals): 5.65,11.75 28.4,11.75 32.15,15.5 32.15,48.75 30.4,48.75 30.4,17.25 27.9,14.75 27.4,14.75 24.65,23.75 24.65,67.5 20.15,72 5.65,72 5.65,65.5 15.65,65.5 19.65,61.5 19.65,23.75 15.4,15.75 5.65,15.75
  pour Bottom: 19.7,49.2 24.7,49.2 24.7,38.7 19.6,38.7 19.6,49.2
  pour Bottom: 19.6,35.3 24.7,35.3 24.7,24.7 19.6,24.7
AGND  (via drill 0.3)
  Top 0.15: 30.24,84.8 30.5,84.8 30.5,84.2 U5.17 31,83.95 | C31.1 v34,83.3 | v29.3,82.1 C32.1 | C37.1 v19.8,79.7 20.1,79.7 20.3,79.5 20.3,78.6 R58.1 | 19.9,73.7 20.3,73.7 20.3,74.7 R59.1 | 19.9,73.7 v19.8,73.7 | 19.9,73.7 C38.1 | v23.3,78.4 24.16,78.4 U6.4 | R61.2 33.66,79 v34,79 34.4,78.6 C39.1 | C40.1 34.4,73.2 v33.9,72.7 33.56,72.7 R63.2 | R75.2 v20,95.2 | U7.4 23.57,94.2 v23,94.2 | v18.7,87.5 19.06,87.5 U4.4 | v20,88.6 R79.2 | v29.5,94.4 29.6,94.5 C43.1 | C44.1 29.7,90.2 v29.6,90.3 29.6,90.2 28.8,90.2 28.6,90 28.2,90 C47.1
  Top 0.25: U5.4 30.24,84.8 | U5.14 31,83.95 U5.7 | U5.9 30.24,83.24 30.4,83.4 30.4,83.6 U5.17 31.76,83.44 U5.13 | v21.3,79.6 C30.1 | v30.5,71.2 C41.1
  Bottom 0.15: R38.1 v18.2,81.3 | v18.7,87.5 18.76,87.44 R31.1 | v29.6,90.3 29.14,90.76 R70.2 | v29.5,94.4 29.14,94.04 R69.2
  other vias: 31,84.2 58.9,94.5 59.9,94.5 13.1,96.2 13.1,95.4 40.5,69.7 40.5,70.5
  pour GND (isolate 0.25, rank 3, no thermals): -0.1,100 60.4,100 60.4,85.7 58,85.7 58.1,91.2 42.6,91.2 42.7,68.9 0,68.9 -0.2,82.4 -0.1,82.4
  pour Top (no thermals): 58.5,94.8 60.3,94.8 60.3,93.6 58.5,93.6
  pour Bottom (isolate 0.15, rank 2, no thermals): 12.7,96.6 13.7,96.6 13.7,95 12.7,95
  pour Top (no thermals): 41.1,70.9 40.1,70.9 40.1,69.3 41.1,69.3
AIN0  (via drill 0.3)
  Top 0.15: v28.3,94.1 28.3,93.94 R68.2 29.15,93.09 C43.2 31.7,93.1 v31.7,92.8 | v51.6,92.8 51.6,89.5 X2.P39
  Bottom 0.15: R69.1 28.26,94.1 v28.3,94.1 | v51.6,92.8 v31.7,92.8
AIN1  (via drill 0.3)
  Top 0.15: v28.3,90.6 28.3,90.76 R71.2 29.15,91.61 C44.2 v31.8,91.6 | v52.8,92.8 52.8,89.3 51.6,88.1 51.6,87 X2.P40
  Bottom 0.15: v28.3,90.6 28.26,90.6 R70.1 | v52.8,92.8 52.2,92.2 51.3,92.2 51.1,92.4 32.5,92.4 31.7,91.6 v31.8,91.6
AIN1_0-10V  (via drill 0.3)
  Top 0.15: C37.2 v18.7,77.4 18.7,77.3 R56.2
  Top 0.4: C35.2 9.82,79 X5.1
  Bottom 0.15: v18.7,77.4 14.4,77.4 14.4,78.9 RV4.2
  Bottom 0.4: RV4.2 9.82,79 X5.1
AIN1_PT100  (via drill 0.3)
  Top 0.15: v22.7,93 23.1,92.6 24.57,92.6 U7.3
  Top 0.4: X5.9 9.82,93 C45.2
  Bottom 0.15: 19.2,92.6 18.6,92.6 17.8,91.8 14.3,91.8 14.3,92.8 RV6.2 | 20.6,92.6 19.2,92.6 | 19.2,92.6 R72.2 | v22.7,93 22.1,92.6 20.6,92.6 | 20.6,92.6 R76.1
  Bottom 0.4: RV6.2 14.29,92.97 X5.9
AIN2  (via drill 0.3)
  Top 0.15: R60.2 32.9,76.6 R61.1 34.4,76.56 C39.2 35.4,76.6 v35.4,79.3 | v52.9,80.5 52.9,87.2 54.1,88.4 X2.P37
  Bottom 0.15: v35.4,79.3 35.4,80.7 52.7,80.7 v52.9,80.5
AIN2_0-10V  (via drill 0.3)
  Top 0.15: C38.2 v18.7,76.5 19.76,76.5 R57.2
  Top 0.4: C36.2 8.6,75.8 7.3,77.1 X5.2
  Bottom 0.15: v18.7,76.5 18.2,77 14.4,77 14.4,75.9 RV5.2
  Bottom 0.4: RV5.2 8.6,75.8 7.3,77.1 X5.2
AIN2_PT100  (via drill 0.3)
  Top 0.15: U7.5 23.93,91 23.1,91 v22.7,90.6
  Top 0.4: X5.7 9.82,89.5 C46.2
  Bottom 0.15: RV7.2 14.3,89.6 14.3,90.9 14.8,91.4 17.6,91.4 17.8,91.2 19.2,91.2 R77.2 R81.1 22.06,91.24 v22.7,90.6
  Bottom 0.4: X5.7 9.82,89.5 RV7.2
AIN3  (via drill 0.3)
  Top 0.15: R62.2 32.9,75 R63.1 34.4,75.04 C40.2 35.7,75 35.8,75.1 35.8,77.9 v36,78.6 | v54.1,79.9 54.1,86.9 X2.P38
  Bottom 0.15: v54.1,79.9 52.6,79.9 52.2,80.3 36,80.3 v36,78.6
AOUT1_0-10V  (2 unrouted)
  Top 0.4: 9.7,86 14.4,86
  Bottom 0.15: R40.1 18.8,85 18.8,84.9 14.4,84.9 14.4,86.1 RV3.2 14.48,86.06 | 9.8,86.06 X5.5
  Bottom 0.4: 9.8,86.06 14.48,86.06
AOUT2_0-10V
  Top 0.15: C33.2 14.68,82.55 13.41,82.55 13.41,82.4 | 9.7,82.4 9.6,82.55 X5.3
  Top 0.4: 9.7,82.4 13.41,82.4 14.5,82.4
  Bottom 0.15: R41.1 18.8,83.6 18.8,83.7 14.4,83.7 14.4,82.5 RV2.2 14.68,82.55 | 9.6,82.55 X5.3
  Bottom 0.4: 9.6,82.55 14.68,82.55
DGND  (via drill 0.3)
  Top 0.15: 82.9,56.3 83.21,55.84 | 83.21,55.84 84.3,54.2 86.1,54.2 86.5,53.9 86.5,51.8 86.2,51.5 83.9,51.5 83.2,50.4 83.2,50.2 | C49.1 87.6,55.1 87.2,54.7 87.2,49.8 v87,49.6 U8.4 84.53,49.53 84.53,46.99 81.99,46.99 81.99,49.53 83.26,50.8 C50.1 | v82.8,45.4 C52.1 | v60.2,61.8 U16.4 | v66.3,53.7 C48.1 | v27.3,62.6 27.3,63.5 OC16.3 | v27.3,59.2 27.3,60.1 OC15.3 | v27.3,55.8 27.3,56.7 OC14.3 | v27.3,52.3 27.3,53.2 OC13.3 | v38.8,50.4 38.8,49.6 38.7,49.5 38.8,49.4 OC8.2 | v38.8,47.1 38.8,46.2 38.9,46.1 38.8,46 OC7.2 | v38.8,43.7 38.8,42.8 OC6.2 | v38.8,27.1 38.8,26.2 OC1.2 | v38.8,30.5 38.8,29.6 OC2.2 | v38.8,33.7 38.8,32.8 OC3.2 | v38.8,37 38.8,36.1 OC4.2 | v38.8,40.4 38.8,39.5 OC5.2 | C51.1 83.26,55.88 83.21,55.84
  Top 0.25: 82.9,56.3 v79.4,56.3 v79.4,50.2 83.2,50.2
  Top 0.6: 82.9,68.5 U3.5 v81.2,68.3
  Bottom 0.4: R27.2 v81.2,68.3
  other vias: 89,70.5 89,69.4 89,68.3 99.6,80.1 99.6,76.9 102.1,76.9 102.1,80.1 97.9,73 95.6,6.6 95.6,5.8 78,14.7 43.5,69.7 43.5,70.5 87.7,95.4 100.8,95.4 109.6,95.4
  pour GND (isolate 0.25, rank 4, no thermals): 0.3,99.7 119.9,100 119.9,71 99.9,71 99.9,52 119.9,52 119.9,51.7 120,51.7 120,0 -0.1,0 -0.1,0.4
  pour Top (no thermals): 82.9,67.9 87.2,67.9 87.2,71.3 89.8,71.3 89.8,66.9 82.9,66.9
  pour Top (no thermals): 98.9,81.2 103,81.2 103,75.9 98.9,75.9
  pour Top (no thermals): 96.4,73.5 98.6,73.5 98.6,72.5 96.4,72.5
  pour Top (no thermals): 96.1,7 95.2,7 95.2,5.4 96.1,5.4
  pour Top (no thermals): 44.1,70.9 43.1,70.9 43.1,69.3 44.1,69.3
  pour Top (no thermals): 86.9,96.2 86.9,91.5 113.8,91.5 113.8,93.4 113.8,96.4 86.9,96.4
  pour Bottom (no thermals): 86.9,96.4 113.8,96.4 113.8,91.5 86.9,91.5
FB_LMR62  (via drill 0.3)
  Top 0.6: U3.4 82.15,70.25 v82.1,70.3
  Bottom 0.4: v82.1,70.3 81.06,70.3 R27.1 | v82.1,70.3 82.81,70.3 C14.1 | R26.2 v82.1,70.3
I2C1_SCL
  Top 0.15: X7.3 76.8,91.7 77.1,91.4 78.3,91.4 79.5,90.2 X2.P17
I2C1_SDA
  Top 0.15: X7.4 74.8,91.4 76.5,91.4 78.2,89.7 78.2,89.4 79.5,88.1 79.5,87 X2.P18
I2C2_SCL  (via drill 0.3)
  Top 0.15: 29.51,85 U5.5 29.5,85 28.4,85 28.3,84.9 28.3,83.8 28,83.5 28,82.7 | v74.6,81.5 74.6,82.6 | v27.8,81.5 28,81.7 28,82.7 | TP3.TP 28,82.7 | v58.7,81.7 58.7,57.5 61.5,57.5 61.5,55.6 U16.6 61.5,55.5 v61.5,51.5 | v88.6,51.5 88.6,50.9 89.9,50.9 U8.6 | 74.6,82.6 74.6,84.8 75.7,85.9 75.7,87.1 77,88.4 77,89.5 X2.P19 | 74.6,82.6 R86.2
  Bottom 0.15: v27.8,81.5 58.7,81.5 | 58.7,81.5 v74.6,81.5 | 58.7,81.5 v58.7,81.7 | v61.5,51.5 v88.6,51.5
I2C2_SDA  (via drill 0.3)
  Top 0.15: 77,80.8 v77,80.9 77,82.6 | U5.8 29.5,83.4 28.5,83.4 28.4,83.3 v28.4,80.9 27,80.9 26.9,81 TP4.TP | 77,82.6 77,86.9 X2.P20 | 77,82.6 R54.2 | U8.5 90.88,49.53 91.5,49.53 v91.5,50.9 | v58.1,80.9 58.3,80.7 58.3,57 60.2,57 60.2,55.6 U16.5 60.2,55.5 v60.2,50.9
  Bottom 0.15: v77,80.9 74.3,80.9 74.1,81.1 58.1,81.1 | 58.1,81.1 28.6,81.1 v28.4,80.9 | 58.1,81.1 v58.1,80.9 | v91.5,50.9 88.3,50.9 88.1,51.1 62,51.1 61.8,50.9 v60.2,50.9
IN_1  (via drill 0.3)
  Top 0.15: R42.1 12.03,54.6 v10.3,54.6 10.3,54.19 C19.2
  Top 0.5: X4.6 C19.2
  Bottom 0.15: LED14.1 12,52.9 v10.3,54.6
IN_2  (via drill 0.3)
  Top 0.15: R43.1 12,58.1 v10.2,58.1 10.2,57.78 C20.2
  Top 0.5: 11.44,56.4 C20.2 7.3,56.44 X4.5
  Bottom 0.15: LED15.1 11.86,56.44 v10.2,58.1
IN_3  (via drill 0.3)
  Top 0.15: R44.1 12.05,61.5 v10.1,61.5 10.1,61.27 C21.2
  Top 0.5: 11.49,59.9 C21.2 7.3,59.88 X4.4
  Bottom 0.15: LED16.1 11.67,59.93 v10.1,61.5
IN_4  (via drill 0.3)
  Top 0.15: R45.1 v10.1,65.1 10.1,64.79 11.49,63.4
  Top 0.5: 11.49,63.4 C22.2 7.3,63.37 X4.3
  Bottom 0.15: LED17.1 11.83,63.37 v10.1,65.1
LDAC  (via drill 0.3)
  Top 0.15: v30.6,86.5 30.8,85.7 U5.3
  Bottom 0.15: R39.1 v30.6,86.5
N$1
  Bottom 0.15: LED2.2 13.8,24.7 13.8,23.44 R18.1
N$2
  Bottom 0.15: LED3.2 13.8,28.42 13.8,27.1 R19.1
N$3
  Bottom 0.15: LED4.2 13.8,31.84 13.8,30.6 14.65,30.6 R20.1
N$4
  Bottom 0.15: R21.1 14.6,34.1 13.8,34.1 13.8,35.3 13,35.3 LED5.2
N$5
  Bottom 0.15: LED6.2 12.99,38.7 13.8,38.7 13.8,37.47 R22.1
N$6
  Bottom 0.15: LED7.2 13.8,42.18 13.8,40.9 R23.1
N$7
  Bottom 0.15: LED8.2 12.99,45.9 13.8,45.9 13.8,44.56 R24.1
N$8
  Bottom 0.15: LED9.2 13.8,49.3 13.8,48.04 R25.1
N$9
  Top 0.15: OC1.3 29.46,26.14 R10.1 26.97,26.37 U1.2
N$10
  Top 0.15: R1.2 40.4,24.9 38.8,24.9 OC1.1
N$11
  Top 0.15: R2.2 38.8,28.3 OC2.1
N$12
  Top 0.15: R3.2 40.5,31.5 38.8,31.5 OC3.1
N$13
  Top 0.15: R4.2 40.4,34.8 38.8,34.8 OC4.1
N$14
  Bottom 0.15: R9.1 12.95,10.09 LED1.2
N$15
  Top 0.15: OC2.3 31.21,29.5 30.15,29.5 30.15,27.78 R11.1 29.26,28.02 U1.4
N$16
  Top 0.15: OC3.3 30.15,32.73 30.15,30.6 29.3,30.6 R12.1 29.3,31.22 U1.8
N$17
  Top 0.15: OC4.3 31.21,36.2 R13.1 28.25,36.2 28.25,32.8 26.92,32.8 U1.10
N$18
  Top 0.75: RF1.8 109.38,90 ANT1.1
N$19
  Top 0.15: R82.2 61.3,60.26 U16.3
N$20
  Top 1.27: PTC1.P$1 89.8,81.17 L2.2
N$21
  Top 0.15: R58.2 R56.1 21.94,77.4 22.8,77.4 23.7,76.5 25.2,76.5 25.66,76.97 U6.3
N$22
  Top 0.15: R5.2 40.4,38.1 38.8,38.1 OC5.1
N$23
  Top 0.15: R6.2 38.8,41.5 OC6.1
N$24
  Top 0.15: R7.2 40.4,44.8 38.8,44.8 OC7.1
N$25
  Top 0.15: R8.2 40.4,48.2 38.9,48.2 OC8.1
N$26
  Top 0.15: OC5.3 29.27,39.41 R14.1 28.43,40.34 U2.2
N$27
  Top 0.15: OC6.3 30.82,42.75 R15.1 28.52,41.94 U2.4
N$28
  Top 0.15: OC7.3 31.21,46.35 R16.1 28.08,45.14 U2.8
N$29
  Top 0.15: OC8.3 30.71,49.46 R17.1 28,46.74 U2.10
N$30
  Bottom 0.15: R50.1 14.63,54.07 LED14.2
N$31
  Bottom 0.15: LED15.2 14.63,57.71 R51.1
N$32
  Bottom 0.15: LED16.2 14.63,61.2 R52.1
N$33
  Bottom 0.15: LED17.2 14.63,64.54 R53.1
N$34
  Top 0.15: R42.2 R46.1 17.11,54.64 C15.2 19.61,54.51 OC13.1
N$35
  Top 0.25: BAT1.P2(+) 78,13.8 79.7,15.5 79.7,23.2 | 79.7,23.2 79.7,36 78.3,37.4 78.3,44.2 78.6,44.5 78.6,45.8 U9.1 | 78.1,23.2 79.7,23.2
N$36
  Top 0.15: OC14.1 19.64,58.02 C16.2 17.11,58.15 R47.1 R43.2
N$39
  Top 0.15: R29.1 85.05,70.31 U3.3
N$42
  Top 0.15: OC15.1 19.62,61.48 C17.2 17.11,61.61 R48.1 15.76,61.56 R44.2
N$45
  Top 0.15: R57.1 R59.2 23.9,74.7 24.39,74.2 U6.5
N$46
  Top 0.15: R87.2 79.8,49 79.5,48.7 U9.3
N$47
  Top 0.15: U8.3 84.5,50.87 R87.1 82.8,48.96 C52.2
N$48
  Top 0.15: U19.P$2 81,51.91 C50.2 83.2,52.13 U8.2
N$49
  Top 0.15: OC16.1 19.55,64.94 C18.2 17.11,65.07 R49.1 15.78,65.1 R45.2
N$50
  Top 0.15: U5.10 30.75,81.03 C32.2
N$51
  Top 0.15: U8.1 83.3,53.41 C51.2 81,54.69 U19.P$1
OPA21_-IN_A  (via drill 0.3)
  Top 0.15: U4.2 22.33,88.27 v22.3,88.3
  Bottom 0.15: R32.2 22.7,86.4 22.7,87.1 22.66,87.26 v22.3,88.3 21.4,87.3 21.04,86.44 R31.2
OPA21_-IN_B  (via drill 0.3)
  Top 0.15: U4.6 21.06,80.53 v21.1,80.5
  Bottom 0.15: R33.2 21.96,81.36 v21.1,80.5 20.44,81.16 R38.2
OPA21_AOUTB  (via drill 0.3)
  Top 0.15: U4.7 22.33,83.56 v22.3,83.6
  Bottom 0.15: R41.2 v22.3,83.6 23.2,83.6 23.64,83.16 R33.1
OPA21_OUT_A  (via drill 0.3)
  Top 0.15: U4.1 v23.6,85.2
  Bottom 0.15: 23.6,86.37 R32.1 23.64,85.24 v23.6,85.2 20.64,85.2 R40.2 20.64,85.2
OPA2170_-IN_A_2  (via drill 0.3)
  Top 0.15: U6.2 26.9,78.16 v26.9,76.6
  Bottom 0.15: R65.1 26.9,77.8 v26.9,76.6
OPA2170_-IN_B_2  (via drill 0.3)
  Top 0.15: U6.6 25.7,73.44 v25.7,75
  Bottom 0.15: R64.1 25.7,73.8 v25.7,75
OPA2170_OUT_A_2  (via drill 0.3)
  Top 0.15: U6.1 v28.2,76.6 R60.1
  Bottom 0.15: v28.2,76.6 28.44,76.6 R65.2
OPA2170_OUT_B_2  (via drill 0.3)
  Top 0.15: U6.7 26.9,73.44 v26.9,75 R62.1
  Bottom 0.15: R64.2 26.9,73.8 v26.9,75
OPA2188_-IN_A
  Top 0.15: 20,92.6 18.5,92.6 R73.2 | 20,92.6 21.6,92.6 R74.1 22.06,92.1 24.7,92.1 25.23,92.63 U7.2 | 20,92.6 R75.1
OPA2188_-IN_B
  Top 0.15: R78.2 R79.1 R80.1 21.96,91.6 24,91.6 24.57,91.03 U7.6
OPA2188_VOUT_A  (via drill 0.3)
  Top 0.15: R74.2 21.6,94.8 v21.2,95.2 21.4,95.4 25.6,95.4 25.86,95.14 U7.1 25.86,93.1 R68.1
  Bottom 0.15: R76.2 20.6,94.6 v21.2,95.2
OPA2188_VOUT_B  (via drill 0.3)
  Top 0.15: R80.2 22.54,89.56 v22.7,89.4 22.7,89.3 23.5,88.5 24.9,88.5 25.2,88.8 25.2,89.74 U7.7 25.2,89.8 25.2,91.1 25.7,91.6 R71.1
  Bottom 0.15: R81.2 22.54,89.56 v22.7,89.4
OUT_1  (via drill 0.3)  (2 unrouted)
  Bottom 0.15: v16,26 16,25.4 15.31,24.71 LED2.1
  Bottom 0.5: 7.3,24.8 11.7,24.8
  other vias: 16,26.9 18.9,26.9 18.9,26
  pour Top (no thermals): 15.6,27.4 19.3,27.4 19.3,25.4 15.6,25.4
  pour PWR (isolate 0.15, rank 2, no thermals): 6.1,25.9 12.7,25.9 14,27.4 19.3,27.4 19.3,25.4 15.6,25.4 14.3,23.9 6.1,23.9
OUT_2  (via drill 0.3)  (1 unrouted)
  Bottom 0.15: v16,28.4 14.63,28.4 LED3.1
  Bottom 0.5: X4.13 11.6,28.4
  other vias: 16,29.3 18.9,29.3 18.9,28.4
  pour Top (no thermals): 15.6,29.8 19.3,29.8 19.3,27.8 15.6,27.8
  pour PWR (isolate 0.15, rank 2, no thermals): 19.3,29.8 15.4,29.8 11.7,29.4 6.1,29.4 6.1,27.4 9.4,27.4 14,27.8 19.3,27.8
OUT_3  (via drill 0.3)  (1 unrouted)
  Bottom 0.15: v16,31.7 14.63,31.7 LED4.1 | 7.3,31.8 7.06,31.75 X4.12
  Bottom 0.5: 7.3,31.8 11.7,31.8
  other vias: 18.9,31.7 18.9,30.8 16,30.8
  pour Top (isolate 0.15, rank 3, no thermals): 15.6,32.3 19.3,32.3 19.3,30.2 15.6,30.2
  pour PWR (isolate 0.15, rank 2, no thermals): 19.3,32.2 15.5,32.2 8.2,32.9 6.1,32.9 6.1,30.9 8.2,30.9 15.5,30.2 19.3,30.2
OUT_4  (via drill 0.3)  (2 unrouted)
  Bottom 0.15: v16,34.1 16,34.7 15.4,35.3 14.65,35.3 LED5.1
  Bottom 0.5: 11.6,35.3 7.4,35.3
  other vias: 16,33.2 18.9,34.1 18.9,33.2
  pour Top (isolate 0.15, rank 2, no thermals): 15.6,34.7 19.3,34.7 19.3,32.6 15.6,32.6
  pour PWR (isolate 0.15, rank 2, no thermals): 19.3,32.6 15.5,32.6 13.9,34.4 6.1,34.4 6.1,36.4 14.5,36.4 16.5,34.7 19.3,34.7
OUT_5  (via drill 0.3)  (1 unrouted)
  Bottom 0.15: v16,39.9 16,39 15.7,38.7 14.67,38.7 LED6.1 | 7.3,38.8 X4.10
  Bottom 0.5: 11.5,38.8 7.3,38.8
  other vias: 16,40.8 18.9,40.8 18.9,39.9
  pour Top (no thermals): 15.6,41.3 19.3,41.3 19.3,39.3 15.6,39.3
  pour PWR (isolate 0.15, rank 2, no thermals): 6.2,37.9 14.2,37.9 15.6,39.3 19.3,39.3 19.3,41.3 15.6,41.3 14.2,39.9 6.1,39.9 6.1,37.9
OUT_6  (via drill 0.3)  (1 unrouted)
  Bottom 0.15: v16,42.3 14.63,42.3 LED7.1 | 7.3,42.3 X4.9
  Bottom 0.5: 11.5,42.3 7.3,42.3
  other vias: 16,43.2 18.9,43.2 18.9,42.3
  pour Top (no thermals): 15.6,43.7 19.3,43.7 19.3,41.8 15.6,41.8
  pour PWR (isolate 0.15, rank 2, no thermals): 19.3,43.7 15.1,43.7 14.8,43.4 6.1,43.4 6.1,41.4 14.8,41.4 15.2,41.8 19.3,41.8
OUT_7  (via drill 0.3)  (1 unrouted)
  Bottom 0.15: v16,45.6 15.73,45.87 LED8.1 | 8.33,45.72 8.33,45.9
  Bottom 0.5: 11.5,45.9 8.33,45.9 X4.8 7.2,45.9
  other vias: 16,44.7 18.9,45.6 18.9,44.7
  pour Top (no thermals): 15.6,44.2 19.3,44.2 19.3,46.1 15.6,46.1
  pour PWR (isolate 0.15, rank 2, no thermals): 19.3,44.2 14,44.2 13.2,44.9 6.1,44.9 6.1,46.9 13.6,46.9 14.4,46.1 19.3,46.1
OUT_8  (via drill 0.3)  (1 unrouted)
  Bottom 0.15: v16,48 16,48.8 15.5,49.3 14.65,49.3 LED9.1 | 7.2,49.3 7.3,49.3 X4.7
  Bottom 0.5: 11.5,49.3 7.2,49.3
  other vias: 16,47.1 18.9,48 18.9,47.1
  pour Top (isolate 0.15, no thermals): 15.6,48.5 19.3,48.5 19.3,46.6 15.6,46.6
  pour PWR (isolate 0.15, rank 2, no thermals): 19.3,48.5 15.6,48.5 13.7,50.4 6.2,50.4 6.1,50.4 6.1,48.4 12.9,48.4 14.7,46.6 16.3,46.6 19.3,46.6
P8_07  (via drill 0.3)
  Top 0.15: v41.5,27.6 41.5,26.7 41.4,26.6 40.5,26.6 R1.1 | X1.P7 92.2,41.1 92.2,40 93.3,38.9 93.3,38.2 92.6,37.5 92.6,29 92.8,28.8 v92.8,27.6
  Bottom 0.15: v41.5,27.6 v92.8,27.6
P8_08  (via drill 0.3)
  Top 0.15: v41.5,28.5 41.5,29.9 41.4,30 40.6,30 R2.1 | v92.2,28.5 92.2,38.5 X1.P8
  Bottom 0.15: v41.5,28.5 42,28 91.7,28 v92.2,28.5
P8_09  (via drill 0.3)
  Top 0.15: v42.4,28.6 41.9,29.1 41.9,33.1 41.8,33.2 40.6,33.2 R3.1 | v90.9,28.6 90.9,38.8 89.7,40 X1.P9
  Bottom 0.15: v90.9,28.6 90.7,28.4 42.6,28.4 v42.4,28.6
P8_10  (via drill 0.3)
  Top 0.15: v42.5,29.5 42.3,29.7 42.3,33.3 41.8,33.8 41.8,36.4 41.7,36.5 40.5,36.5 R4.1 | X1.P10 v89.7,29.3
  Bottom 0.15: v42.5,29.5 43.2,28.8 89.1,28.8 89.6,29.3 v89.7,29.3
P8_11  (via drill 0.3)
  Top 0.15: v43.4,29.5 42.7,30.2 42.7,33.5 42.2,34 42.2,36.6 41.8,37 41.8,39.7 41.7,39.8 40.5,39.8 R5.1 | v88.4,29.4 88.4,38.8 87.2,40 87.2,41.1 X1.P11
  Bottom 0.15: v88.4,29.4 88.2,29.2 43.7,29.2 v43.4,29.5
P8_12  (via drill 0.3)
  Top 0.15: v43.4,30.4 43.1,30.4 43.1,33.7 42.6,34.2 42.6,36.8 42.2,37.2 42.2,39.9 41.8,40.3 41.8,43.1 41.7,43.2 40.5,43.2 R6.1 | v87.2,29.8 87.2,38.5 X1.P12
  Bottom 0.15: v87.2,29.8 87,29.6 44.2,29.6 v43.4,30.4
P8_13  (via drill 0.3)
  Top 0.15: v44.3,30.4 43.5,31.2 43.5,33.9 43,34.4 43,37 42.6,37.4 42.6,40.1 42.2,40.5 42.2,43.3 41.8,43.7 41.8,46.4 41.7,46.5 40.5,46.5 R7.1 | v85.6,30.2 85.6,39 84.6,40 84.6,41.1 X1.P13
  Bottom 0.15: v85.6,30.2 85.4,30 44.7,30 v44.3,30.4
P8_14  (via drill 0.3)
  Top 0.15: v84.6,30.6 84.6,38.5 X1.P14 | v44.2,31.4 43.9,31.4 43.9,34.1 43.4,34.6 43.4,37.2 43,37.6 43,40.3 42.6,40.7 42.6,43.5 42.2,43.9 42.2,46.6 41.8,47 41.8,49.7 41.7,49.8 40.5,49.8 R8.1
  Bottom 0.15: v84.6,30.6 84.4,30.4 45.2,30.4 v44.2,31.4
P8_15  (via drill 0.3)
  Top 0.15: 28.9,54.6 27.3,54.6 OC13.4 | v30.6,52.1 30.6,54.3 30.2,54.7 30.1,54.6 28.9,54.6 | v76.4,46.4 v76.4,52.1 | v81.8,46.2 81.8,42.8 82.1,42.5 82.1,41.1 X1.P15 | 28.9,54.6 R34.1
  Bottom 0.15: v30.6,52.1 61.8,52.1 62,51.9 76.2,51.9 v76.4,52.1 | v76.4,46.4 81.6,46.4 v81.8,46.2
P8_16  (via drill 0.3)
  Top 0.15: OC14.4 27.3,58 28.8,58 R35.1 28.9,58 30.1,58 30.2,57.9 30.2,57.7 30.5,57.4 30.5,55 31,54.5 31,52.9 v31.2,52.7 | v60.9,50.3 v60.9,52.7 | v78.5,47.4 v78.5,50.5 | v81.2,47.4 81.2,45.9 81.4,45.7 81.4,41.9 81.1,41.6 81.1,40.6 82.1,39.6 82.1,38.6 X1.P16
  Bottom 0.15: v31.2,52.7 31.4,52.5 60.7,52.5 v60.9,52.7 | v60.9,50.3 61.1,50.5 62,50.5 62.2,50.7 78.3,50.7 v78.5,50.5 | v81.2,47.4 v78.5,47.4
P8_17  (via drill 0.3)
  Top 0.15: OC15.4 27.3,61.4 28.8,61.4 R36.1 28.9,61.4 30.1,61.4 30.5,61 30.5,58.2 30.6,58.1 30.6,57.9 30.9,57.6 30.9,55.2 31.4,54.7 31.4,53.4 31.8,53 v31.8,51.5 | v79.6,45.8 79.6,42.7 79.5,42.6 79.5,41.1 X1.P17 | v77.7,50.1 v77.7,45.8 | v59.6,51.5 v59.6,49.7
  Bottom 0.15: v77.7,45.8 v79.6,45.8 | v77.7,50.1 77.5,50.3 62.4,50.3 62.2,50.1 61.6,50.1 61.2,49.7 v59.6,49.7 | v59.6,51.5 59.4,51.7 32,51.7 v31.8,51.5
P8_18  (via drill 0.3)
  Top 0.15: OC16.4 27.3,64.8 28.8,64.8 R37.1 28.9,64.8 30.1,64.8 30.4,64.5 30.4,61.7 30.9,61.2 30.9,58.4 31,58.3 31,58.1 31.3,57.8 31.3,55.4 31.8,54.9 31.8,53.7 v32.4,53.1 | v75.4,52.5 75.4,45.6 75.7,45.3 v75.7,34.6 | v80.4,34.6 80.2,34.8 80.2,36.1 79.5,36.8 79.5,38.5 X1.P18
  Bottom 0.15: v75.4,52.5 75.2,52.3 65.3,52.3 64.3,53.3 60.6,53.3 60.2,52.9 32.6,52.9 v32.4,53.1 | v80.4,34.6 v75.7,34.6
P8_19  (via drill 0.3)
  Top 0.15: U8.7 92.33,52.13 R55.1 92.4,52 v92.4,47 | X1.P19 v77,47
  Bottom 0.15: v92.4,47 92.2,46.8 77.2,46.8 v77,47
P8_26  (via drill 0.3)
  Top 0.15: v69.4,27 69.4,38.5 X1.P26 | v92.9,26.7 92.9,16.9 93,16.8 93.9,16.8 | 93.9,16.8 D4.A | 93.9,16.8 R28.1
  Bottom 0.15: v69.4,27 69.6,27.2 92.3,27.2 92.8,26.7 v92.9,26.7
P9_12
  Top 0.15: RF1.1 86.14,93.5 R89.1 86,93.4 86,90.7 85.9,90.6 85.9,89.3 87.1,88.1 87.1,87 X2.P12
P9_14  (via drill 0.3)
  Top 0.15: v84.6,83.1 84.6,86.9 X2.P14 | v68.1,83.1 68.1,90.6 68.8,91.3 X7.7
  Bottom 0.15: v84.6,83.1 84.5,83.2 68.2,83.2 v68.1,83.1
P9_15  (via drill 0.3)
  Top 0.15: v82,93.6 82,89.5 X2.P15
  Bottom 0.15: v82,93.6 68.6,93.6 67.5,92.5 X7.8
P9_16  (via drill 0.3)
  Top 0.15: v82,82 82,86.9 X2.P16 | v65.5,82.1 65.5,90.6 64.8,91.3 X7.9
  Bottom 0.15: v82,82 75,82 74.9,82.1 74.3,82.1 74.1,81.9 65.7,81.9 v65.5,82.1
PE  (via drill 1, 3.2 pad 4.5)
  other vias: 105.2,88.6 38.8,85.2 105.3,39.7 4.8,98.8 14.9,98.8 24.9,98.8 34.9,98.8 54.9,98.8 64.9,98.8 74.9,98.8 44.9,98.8 84.9,98.8 94.9,98.8 104.9,98.8 114.9,98.8 4.9,1.2 15,1.2 25,1.2 35,1.2 55,1.2 65,1.2 75,1.2 45,1.2 85,1.2 95,1.2 105,1.2 115,1.2
  pour Top (isolate 0.15, rank 4, no thermals): -0.1,0 -0.1,100 119.9,100 119.8,71 99.9,71 99.9,51.9 107.2,51.9 107.2,49 95.6,49 95.8,75 113.9,75 113.9,85.9 107.8,85.9 107.8,91.4 114.2,91.4 114.2,95.2 107.7,95.2 107.7,85.9 102.7,85.9 102.7,95.2 101.7,95.2 41.6,95.3 41.6,82.6 36.2,82.6 36.2,95.3 17.8,95.3 17.6,95.5 17.6,95.1 17.5,73.4 8.6,73.4 8.6,4.9 107.1,5 107.1,36 101.9,36 102,42.7 107.3,42.7 107.3,51.9 119.8,51.9 119.9,0
  pour Bottom (isolate 0.15, rank 5, no thermals): -0.1,99.9 119.9,99.9 119.9,71 94.1,71 94.1,75.2 101.6,75.2 101.5,95.3 11.9,95.4 11.9,73.5 9.6,73.5 9.3,5.2 102.4,5.2 102.3,45.5 94.1,45.5 94.1,70.9 99.9,70.9 99.9,51.9 119.8,52 119.9,0 -0.1,0
RESET
  Top 0.15: 104.49,18.8 C27.2 | 104.5,20.46 D3.4 108.11,20.5 X6.4
  Top 0.25: D4.C 101.6,16.8 103.6,18.8 104.49,18.8 | C27.2 104.5,20.46
SGND_A  (via drill 0.3)
  Bottom 0.4: v15.6,87 RV3.1 | RV2.1 v15.6,81.6 | v15.6,80 RV4.1 | v15.6,74.9 RV5.1 | RV7.1 v15.6,88.5 | RV6.1 v15.6,94
  other vias: 16,96.2 16,95.4
  pour GND (isolate 0.15, rank 2, no thermals): 12,74.5 17.3,74.5 17.5,96.6 14.8,96.6 14.8,94.5 12,94.5
  pour Bottom (isolate 0.15, rank 2, no thermals): 16.6,96.6 15.6,96.6 15.6,95 16.6,95
SGND_TTL  (via drill 0.3)
  Top 0.15: C28.1 v99.91,19.29 v99.9,19.3 | C29.1 v100.9,24.9
  Top 0.25: C27.1 v104.5,16.6 | C26.1 v102.5,11.9
  other vias: 103.9,23.9 104.7,23.9 103.9,11.1 104.7,11.1 103.7,7.8 104.5,7.8 100.6,6.6 100.6,5.8
  pour GND (isolate 0.25): 98.4,26.8 119.9,26.8 119.8,0 98.3,0
  pour Top (no thermals): 103.6,23.3 104.9,23.3 104.9,24.3 103.6,24.3
  pour Top (no thermals): 103.6,11.6 105,11.6 105,10.7 103.6,10.7
  pour Top (no thermals): 103.3,7.3 104.9,7.3 104.9,8.2 103.3,8.2
  pour Top (no thermals): 100.1,7 100.1,5.4 101,5.4 101,7
SW_LMR62
  Top 0.75: U3.6 81.49,66.9 76.4,66.9
  pour Top (no thermals): 75.1,68.6 78.1,68.6 78.1,66.8 79.2,65.7 80.2,65.7 80.2,62.9 77.1,62.9 75.1,64.9
SYS5V
  Top 0.15: X2.P8 92.15,87.63 92.15,88.9 X2.P7
SYS_RESET  (via drill 0.3)
  Top 0.15: v94.5,45.3 94.7,45.5 94.7,57.7 94.6,57.8 94.6,58.8 94.4,59 94.4,59.6 94.2,59.8 94.2,60.1 92.5,62 92.5,75.9 91,77.4 91,84.3 89.7,85.6 89.7,86.9 X2.P10
  Bottom 0.15: v94.5,45.3 94.7,45.1 111.4,45.1 111.9,44.6 115.5,44.6 T1.2
UART1_RXD  (via drill 0.3)
  Top 0.15: v69.7,59.5 69.3,59.9 69.3,86.9 X2.P26 | v95.4,59.5 95.4,58.2 95.5,58.1 95.5,42.7 96,42.2 96,20.9 96.2,20.7 L3.1
  Bottom 0.15: v69.7,59.5 v95.4,59.5
UART1_RXD_S  (via drill 0.3)
  Top 0.15: v102.5,19.3 102.5,20.46 D3.3 102.33,20.71 C28.2 L3.2
  Bottom 0.15: X6.2 107.53,15.88 105.3,18.1 103.7,18.1 v102.5,19.3
UART1_TXD  (via drill 0.3)
  Top 0.15: X2.P24 71.9,86.9 71.9,85.9 69.7,83.7 69.7,60.9 70.3,60.3 v70.3,60.1 | v94.8,60.1 94.8,59.2 95,59 95,58 95.1,57.9 95.1,42.9 93.8,41.6 v93.8,34.6 | v96.6,34.6 96.4,34.4 96.4,22.7 L4.1
  Bottom 0.15: v70.3,60.1 70.5,59.9 94.6,59.9 v94.8,60.1 | v96.6,34.6 v93.8,34.6
UART1_TXD_S  (via drill 0.3)
  Top 0.15: v102.5,23.9 102.5,22.74 D3.2 C29.2 100.21,22.69 100.2,22.7 L4.2
  Bottom 0.15: X6.3 107.69,18.71 v102.5,23.9
UART2_RXD
  Top 0.15: X7.6 70.8,91.4 71.4,91.4 73.1,89.7 73.1,89.4 74.4,88.1 74.4,87 X2.P22
UART2_TXD
  Top 0.15: X7.5 72.8,91.8 74.4,90.2 X2.P21
VADC_1.8V  (via drill 0.3)
  Top 0.15: v18.5,88.6 R78.1 | v18.6,95.2 18.6,94.2 18.5,94.2 R73.1
  Bottom 0.15: 23.3,90 27.4,90 29.2,88.2 59.4,88.2 60.6,87 61.7,87 X2.P32 | 23.3,90 21.6,90 21.5,90.1 21.4,90.1 21.2,90.3 18.6,90.3 18.4,90.1 18.2,90.1 18.2,88.9 v18.5,88.6 R78.1 R77.1 | 23.3,90 23.3,93.3 23,93.6 22.4,93.6 22.4,94.9 21.5,95.8 19.4,95.8 18.6,95 v18.6,95.2 18.6,94.24 R72.1
VDD5V  (via drill 0.3)
  Top 1.27: PTC1.P$2 C25.1
  other vias: 95.9,80.1 94.1,80.1 96,76.9 94.1,76.9 94,73
  pour Top (no thermals): 93.1,81.2 93.1,75.9 97.3,75.9 97.3,81.2
  pour PWR (no thermals): 93.7,90.7 95.8,90.7 95.8,82.7 97.3,81.2 97.3,76.1 94.8,73.6 94.8,71.7 93,71.7 93,82.9 93.7,83.7
  pour Top (no thermals): 93.3,73.5 95.6,73.5 95.6,72.5 93.3,72.5
VDD5V_F  (via drill 0.3)
  Top 0.15: C47.2 26.23,89.4 U7.8
  Top 0.25: v27.3,71.2 C41.2 28.2,71.22 U6.8 | v26.8,88.4 26.79,88.41 C47.2 | v83.8,82.6 83.8,81 84.5,81 | v81,82.6 81,89.5 78.8,91.7 X7.2
  Top 0.5: v94.6,13.4 D2.A
  PWR 0.5: v85.2,80.8 82.1,77.7 38.9,77.7 | 38.9,77.7 36.3,75.1 36.3,70.1 35.9,69.7 28.2,69.7 27.3,70.6 v27.3,71.2 | v26.8,88.4 26.8,87.4 25.6,86.3 25.6,81 26.5,80.1 36.5,80.1 38.9,77.7 | v86.1,72.4 90.7,72.4 93.7,69.4 93.7,50.9 97.8,47.2 99.1,46.1 102.1,45.9 102.1,32.2 91.8,21.9 91.8,15.1 93.6,13.4 v94.6,13.4
  PWR 1: v85.2,80.8 v85.2,73.2 85.3,73.2 v86.1,72.4
  Bottom 0.25: v83.8,82.6 83.7,82.7 81.1,82.7 v81,82.6
  pour Top (no thermals): 84.5,82 87.1,82 87.1,80.4 84.5,80.4
  pour Top (no thermals): 84.8,68.6 85.8,68.6 85.8,71.6 85.4,72 75,72 75,74.6 78.6,74.6 79.8,73.6 86.7,73.6 86.7,68.3 84.8,68.3
VOUTA
  Top 0.15: U5.1 31.76,86.54 31.2,87.6 26.4,87.6 TP2.TP 25.5,86.3 24.3,84.6 21,84.6 21,86.63 U4.3
VOUTB
  Top 0.15: U5.2 31.25,86.55 30.9,87.2 29.1,87.2 TP1.TP 24.7,84.2 19.8,84.2 U4.5

## Text on the board
Top: top | www.strasys.at | EL-100-010-001 | Rev. 1.0 -proto
Bottom: bottom
tNames: AGND | PT1 | AGND | PT2 | AGND | AO1 | AGND | AO2 | AI2 | AI1 | +24V | +24V | IN4 | IN3 | IN2 | IN1 | U19 | OUT8 | OUT7 | OUT6 | OUT5 | OUT4 | OUT3 | OUT2 | OUT1 | GND | RESET | TXD | PE | RXD | +5V | +24V | 0V
bNames: + | WP | A1 | A0 | - | +
DrillLegend: LAYER-STACK
DrillLegend_01-16: 01-16